# EAGLE design Tortilla (EAGLE 6.2)

## Sheet 1 of 5
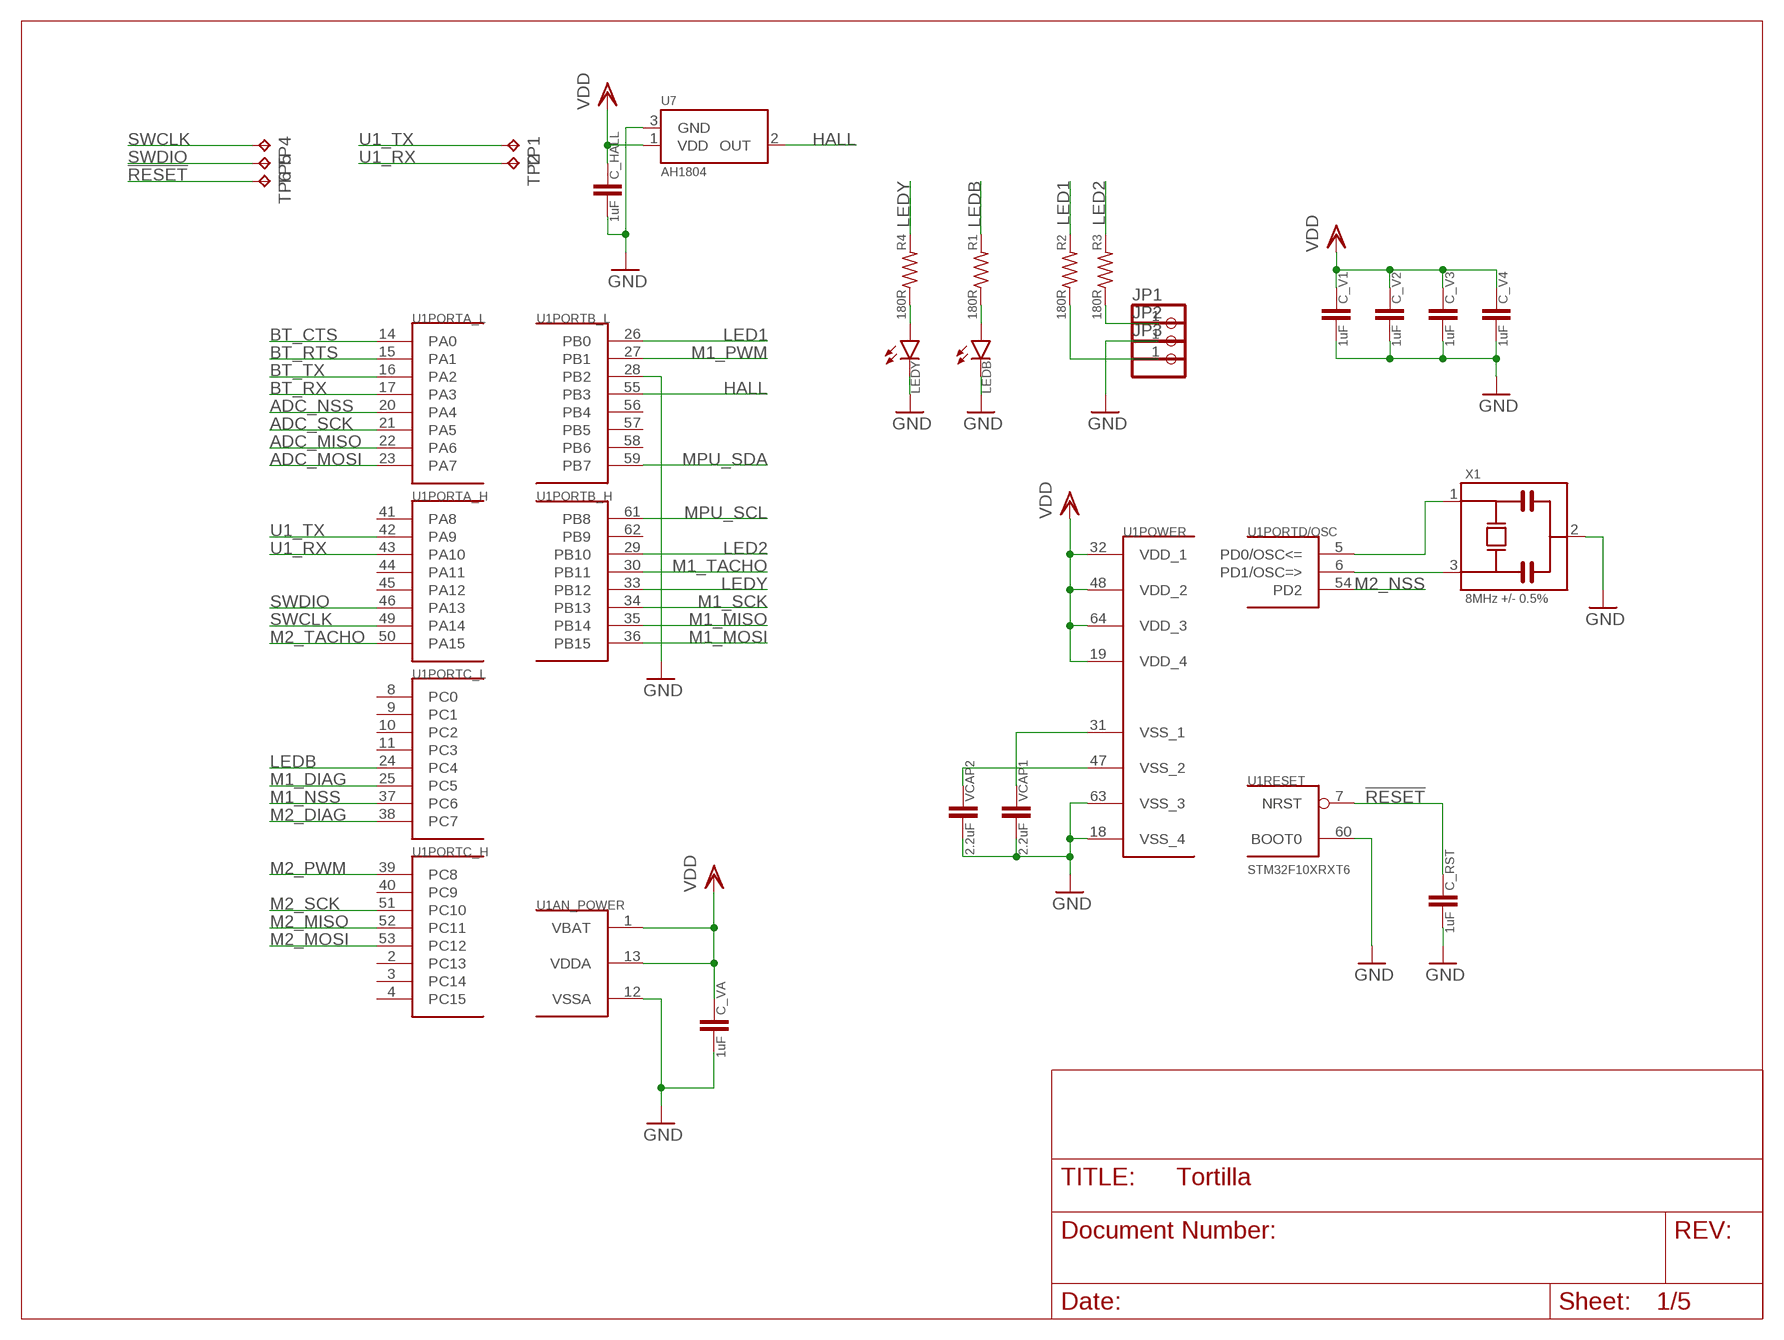
[diagram p0: schematic, sheet 1]

### Parts
C_HALL  1uF  C0603  [0603]
C_RST  1uF  C0603  [0603]
C_V1  1uF  C0603  [0603]
C_V2  1uF  C0603  [0603]
C_V3  1uF  C0603  [0603]
C_V4  1uF  C0603  [0603]
C_VA  1uF  C0603  [0603]
JP1  PINHD-1X1  [1X01]
JP2  PINHD-1X1  [1X01]
JP3  PINHD-1X1  [1X01]
LEDB  LED0805  [0805_POL]
LEDY  LED0805  [0805_POL]
R1  180R  R0603  [0603]
R2  180R  R0603  [0603]
R3  180R  R0603  [0603]
R4  180R  R0603  [0603]
TP1  TPB1,27  [B1,27]
TP2  TPB1,27  [B1,27]
TP4  TPB1,27  [B1,27]
TP5  TPB1,27  [B1,27]
TP6  TPB1,27  [B1,27]
U1  STM32F10XRXT6  [TQFP64]
U7  AH1804  [SOT23-3]
VCAP1  2.2uF  C0603  [0603]
VCAP2  2.2uF  C0603  [0603]
X1  8MHz +/- 0.5%  MURATA_CSTCE  [MURATA_CSTCE]

### Nets
!RESET: C_RST.1 TP6.TP U1.7(RESET:NRST)
ADC_MISO: U1.22(PORTA_L:PA6) ; also sheet 2
ADC_MOSI: U1.23(PORTA_L:PA7) ; also sheet 2
ADC_NSS: U1.20(PORTA_L:PA4) ; also sheet 2
ADC_SCK: U1.21(PORTA_L:PA5) ; also sheet 2
BT_CTS: U1.14(PORTA_L:PA0) ; also sheet 2
BT_RTS: U1.15(PORTA_L:PA1) ; also sheet 2
BT_RX: U1.17(PORTA_L:PA3) ; also sheet 2
BT_TX: U1.16(PORTA_L:PA2) ; also sheet 2
GND: C_HALL.2 C_RST.2 C_V1.2 C_V2.2 C_V3.2 C_V4.2 C_VA.2 JP2.1 LEDB.-(C) LEDY.-(C) U1.12(AN_POWER:VSSA) U1.18(POWER:VSS_4) U1.28(PORTB_L:PB2) U1.60(RESET:BOOT0) U1.63(POWER:VSS_3) U7.3(GND) VCAP1.2 VCAP2.2 X1.2 ; also sheet 2,3,4,5
HALL: U1.55(PORTB_L:PB3) U7.2(OUT)
LED1: R2.2 U1.26(PORTB_L:PB0)
LED2: R3.2 U1.29(PORTB_H:PB10)
LEDB: R1.2 U1.24(PORTC_L:PC4)
LEDY: R4.2 U1.33(PORTB_H:PB12)
M1_DIAG: U1.25(PORTC_L:PC5) ; also sheet 3
M1_MISO: U1.35(PORTB_H:PB14) ; also sheet 3
M1_MOSI: U1.36(PORTB_H:PB15) ; also sheet 3
M1_NSS: U1.37(PORTC_L:PC6) ; also sheet 3
M1_PWM: U1.27(PORTB_L:PB1) ; also sheet 3
M1_SCK: U1.34(PORTB_H:PB13) ; also sheet 3
M1_TACHO: U1.30(PORTB_H:PB11) ; also sheet 3
M2_DIAG: U1.38(PORTC_L:PC7) ; also sheet 4
M2_MISO: U1.52(PORTC_H:PC11) ; also sheet 4
M2_MOSI: U1.53(PORTC_H:PC12) ; also sheet 4
M2_NSS: U1.54(PORTD/OSC:PD2) ; also sheet 4
M2_PWM: U1.39(PORTC_H:PC8) ; also sheet 4
M2_SCK: U1.51(PORTC_H:PC10) ; also sheet 4
M2_TACHO: U1.50(PORTA_H:PA15) ; also sheet 4
MPU_SCL: U1.61(PORTB_H:PB8) ; also sheet 2
MPU_SDA: U1.59(PORTB_L:PB7) ; also sheet 2
N$1: U1.6(PORTD/OSC:PD1/OSC=>) X1.3
N$2: U1.5(PORTD/OSC:PD0/OSC<=) X1.1
N$3: U1.47(POWER:VSS_2) VCAP2.1
N$4: U1.31(POWER:VSS_1) VCAP1.1
N$5: LEDB.+(A) R1.1
N$6: JP1.1 R3.1
N$7: JP3.1 R2.1
N$35: LEDY.+(A) R4.1
SWCLK: TP4.TP U1.49(PORTA_H:PA14)
SWDIO: TP5.TP U1.46(PORTA_H:PA13)
U1_RX: TP2.TP U1.43(PORTA_H:PA10)
U1_TX: TP1.TP U1.42(PORTA_H:PA9)
VDD: C_HALL.1 C_V1.1 C_V2.1 C_V3.1 C_V4.1 C_VA.1 U1.1(AN_POWER:VBAT) U1.13(AN_POWER:VDDA) U1.19(POWER:VDD_4) U1.32(POWER:VDD_1) U1.48(POWER:VDD_2) U1.64(POWER:VDD_3) U7.1(VDD) ; also sheet 2,3,4,5
Unconnected: U1.2(PORTC_H:PC13) U1.3(PORTC_H:PC14) U1.4(PORTC_H:PC15) U1.8(PORTC_L:PC0) U1.9(PORTC_L:PC1) U1.10(PORTC_L:PC2) U1.11(PORTC_L:PC3) U1.40(PORTC_H:PC9) U1.41(PORTA_H:PA8) U1.44(PORTA_H:PA11) U1.45(PORTA_H:PA12) U1.56(PORTB_L:PB4) U1.57(PORTB_L:PB5) U1.58(PORTB_L:PB6) U1.62(PORTB_H:PB9)

## Sheet 2 of 5
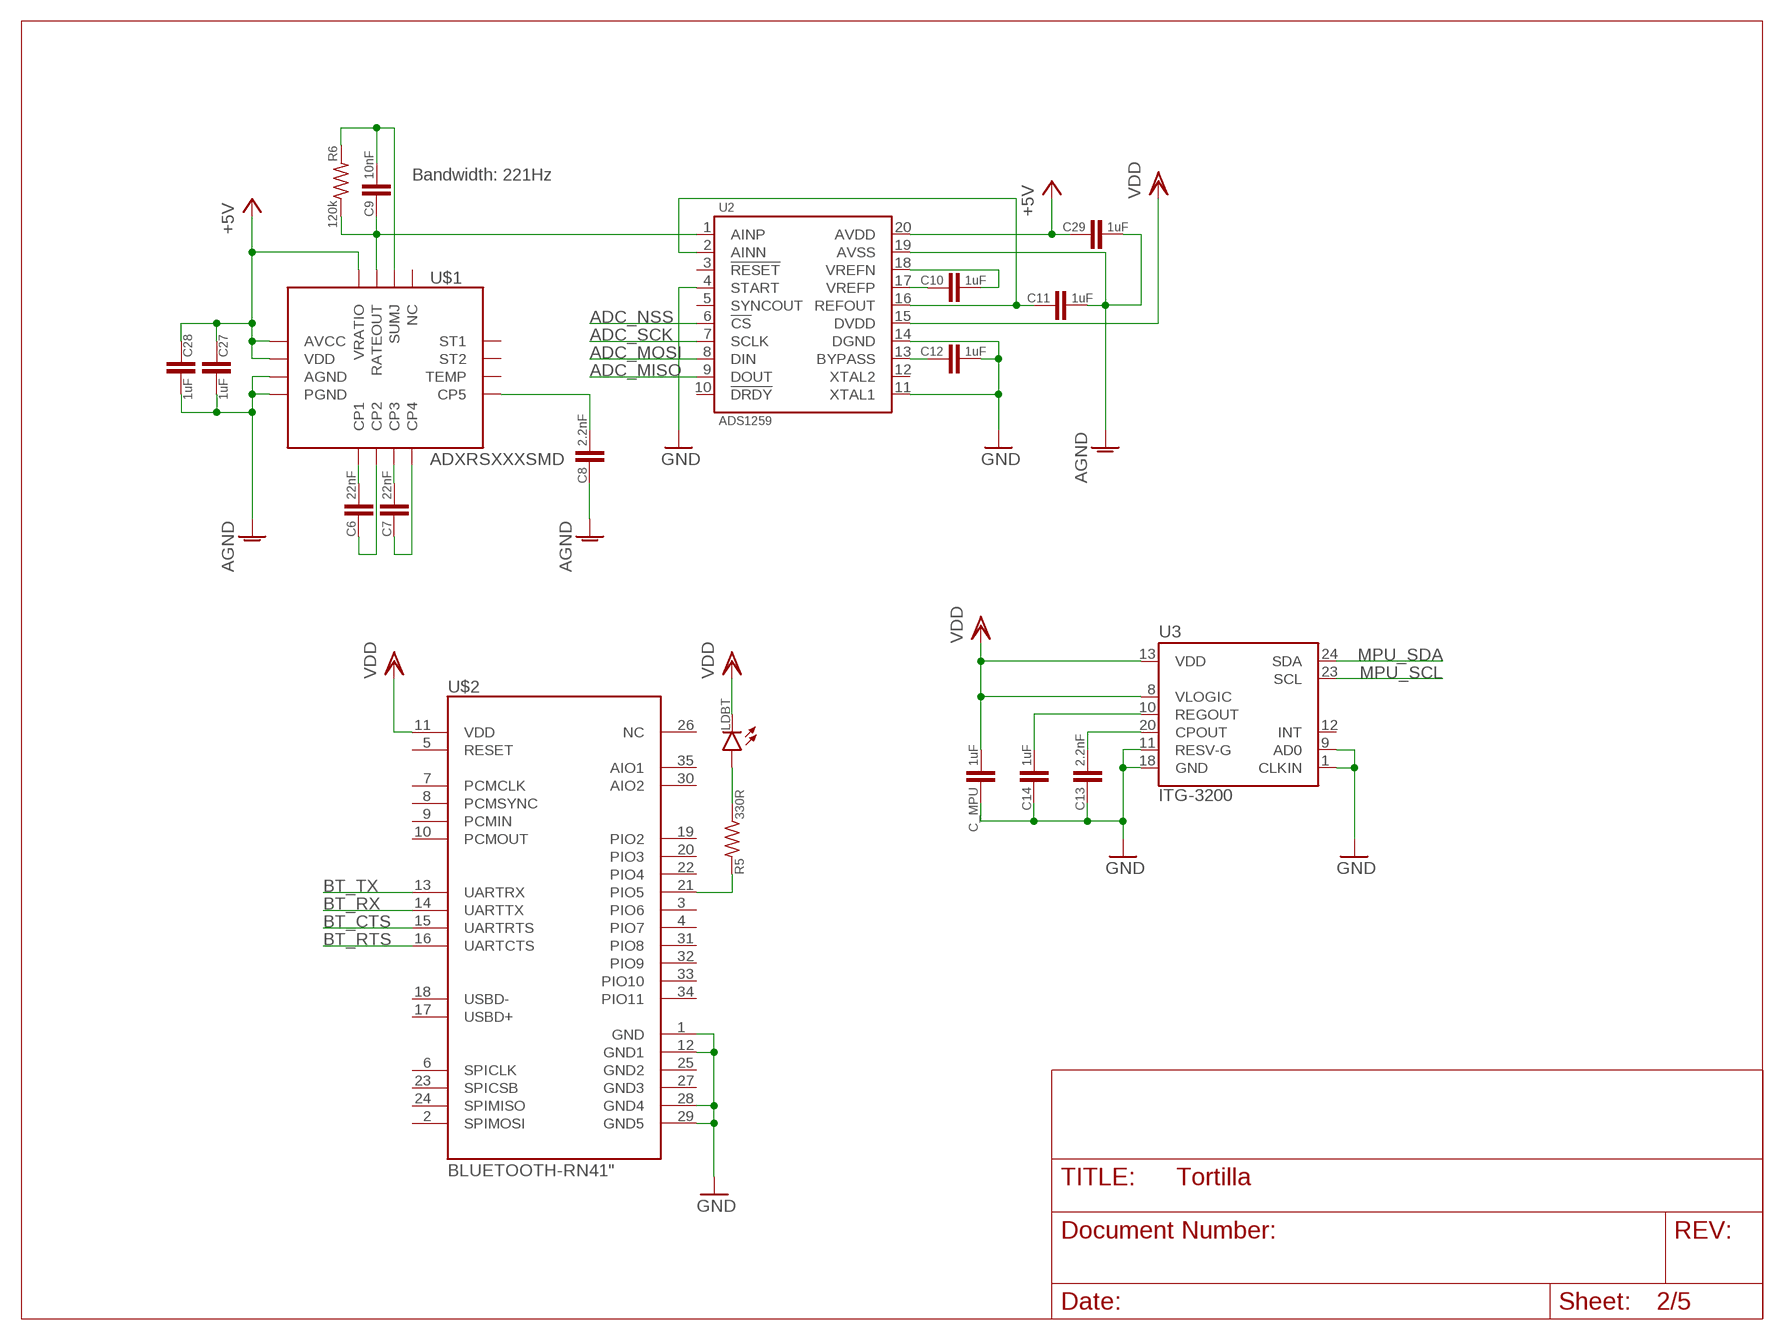
[diagram p1: schematic, sheet 2]

### Parts
C6  22nF  C0603  [0603]
C7  22nF  C0603  [0603]
C8  2.2nF  C0603  [0603]
C9  10nF  C0603  [0603]
C10  1uF  C0603  [0603]
C11  1uF  C0603  [0603]
C12  1uF  C0603  [0603]
C13  2.2nF  C0603  [0603]
C14  1uF  C0603  [0603]
C27  1uF  C0603  [0603]
C28  1uF  C0603  [0603]
C29  1uF  C0603  [0603]
C_MPU  1uF  C0603  [0603]
LDBT  LED0805  [0805_POL]
R5  330R  R0603  [0603]
R6  120k  R0603  [0603]
U2  ADS1259  [TSSOP-20]
U3  ITG-3200  [QFN-24]
U$1  ADXRSXXXSMD  [BC-32]
U$2  BLUETOOTH-RN41"  [RN41]

### Nets
+5V: C27.1 C28.1 C29.1 U2.20(AVDD) U$1.AVCC U$1.VDD U$1.VRATIO ; also sheet 5
ADC_MISO: U2.9(DOUT) ; also sheet 1
ADC_MOSI: U2.8(DIN) ; also sheet 1
ADC_NSS: U2.6(!CS) ; also sheet 1
ADC_SCK: U2.7(SCLK) ; also sheet 1
AGND: C8.1 C11.2 C27.2 C28.2 C29.2 U2.19(AVSS) U$1.AGND U$1.PGND ; also sheet 5
BT_CTS: U$2.15(UARTRTS) ; also sheet 1
BT_RTS: U$2.16(UARTCTS) ; also sheet 1
BT_RX: U$2.14(UARTTX) ; also sheet 1
BT_TX: U$2.13(UARTRX) ; also sheet 1
GND: C12.2 C13.1 C14.1 C_MPU.1 U2.4(START) U2.11(XTAL1) U2.14(DGND) U3.1(CLKIN) U3.9(AD0) U3.11(RESV-G) U3.18(GND) U$2.1(GND) U$2.12(GND1) U$2.28(GND4) U$2.29(GND5) ; also sheet 1,3,4,5
MPU_SCL: U3.23(SCL) ; also sheet 1
MPU_SDA: U3.24(SDA) ; also sheet 1
N$9: C6.2 U$1.CP1
N$10: C6.1 U$1.CP2
N$11: C7.2 U$1.CP3
N$12: C7.1 U$1.CP4
N$13: C8.2 U$1.CP5
N$14: C9.1 R6.1 U2.1(AINP) U$1.RATEOUT
N$15: C9.2 R6.2 U$1.SUMJ
N$16: C11.1 U2.2(AINN) U2.16(REFOUT)
N$17: C10.2 U2.18(VREFN)
N$18: C10.1 U2.17(VREFP)
N$19: C12.1 U2.13(BYPASS)
N$20: C13.2 U3.20(CPOUT)
N$21: C14.2 U3.10(REGOUT)
N$32: R5.2 U$2.21(PIO5)
N$33: LDBT.+(A) R5.1
VDD: C_MPU.2 LDBT.-(C) U2.15(DVDD) U3.8(VLOGIC) U3.13(VDD) U$2.11(VDD) ; also sheet 1,3,4,5
Unconnected: U2.3(!RESET) U2.5(SYNCOUT) U2.10(!DRDY) U2.12(XTAL2) U3.12(INT) U$1.NC U$1.ST1 U$1.ST2 U$1.TEMP U$2.2(SPIMOSI) U$2.3(PIO6) U$2.4(PIO7) U$2.5(RESET) U$2.6(SPICLK) U$2.7(PCMCLK) U$2.8(PCMSYNC) U$2.9(PCMIN) U$2.10(PCMOUT) U$2.17(USBD+) U$2.18(USBD-) U$2.19(PIO2) U$2.20(PIO3) U$2.22(PIO4) U$2.23(SPICSB) U$2.24(SPIMISO) U$2.25(GND2) U$2.26(NC) U$2.27(GND3) U$2.30(AIO2) U$2.31(PIO8) U$2.32(PIO9) U$2.33(PIO10) U$2.34(PIO11) U$2.35(AIO1)

### Notes on the sheet
- Bandwidth: 221Hz

## Sheet 3 of 5
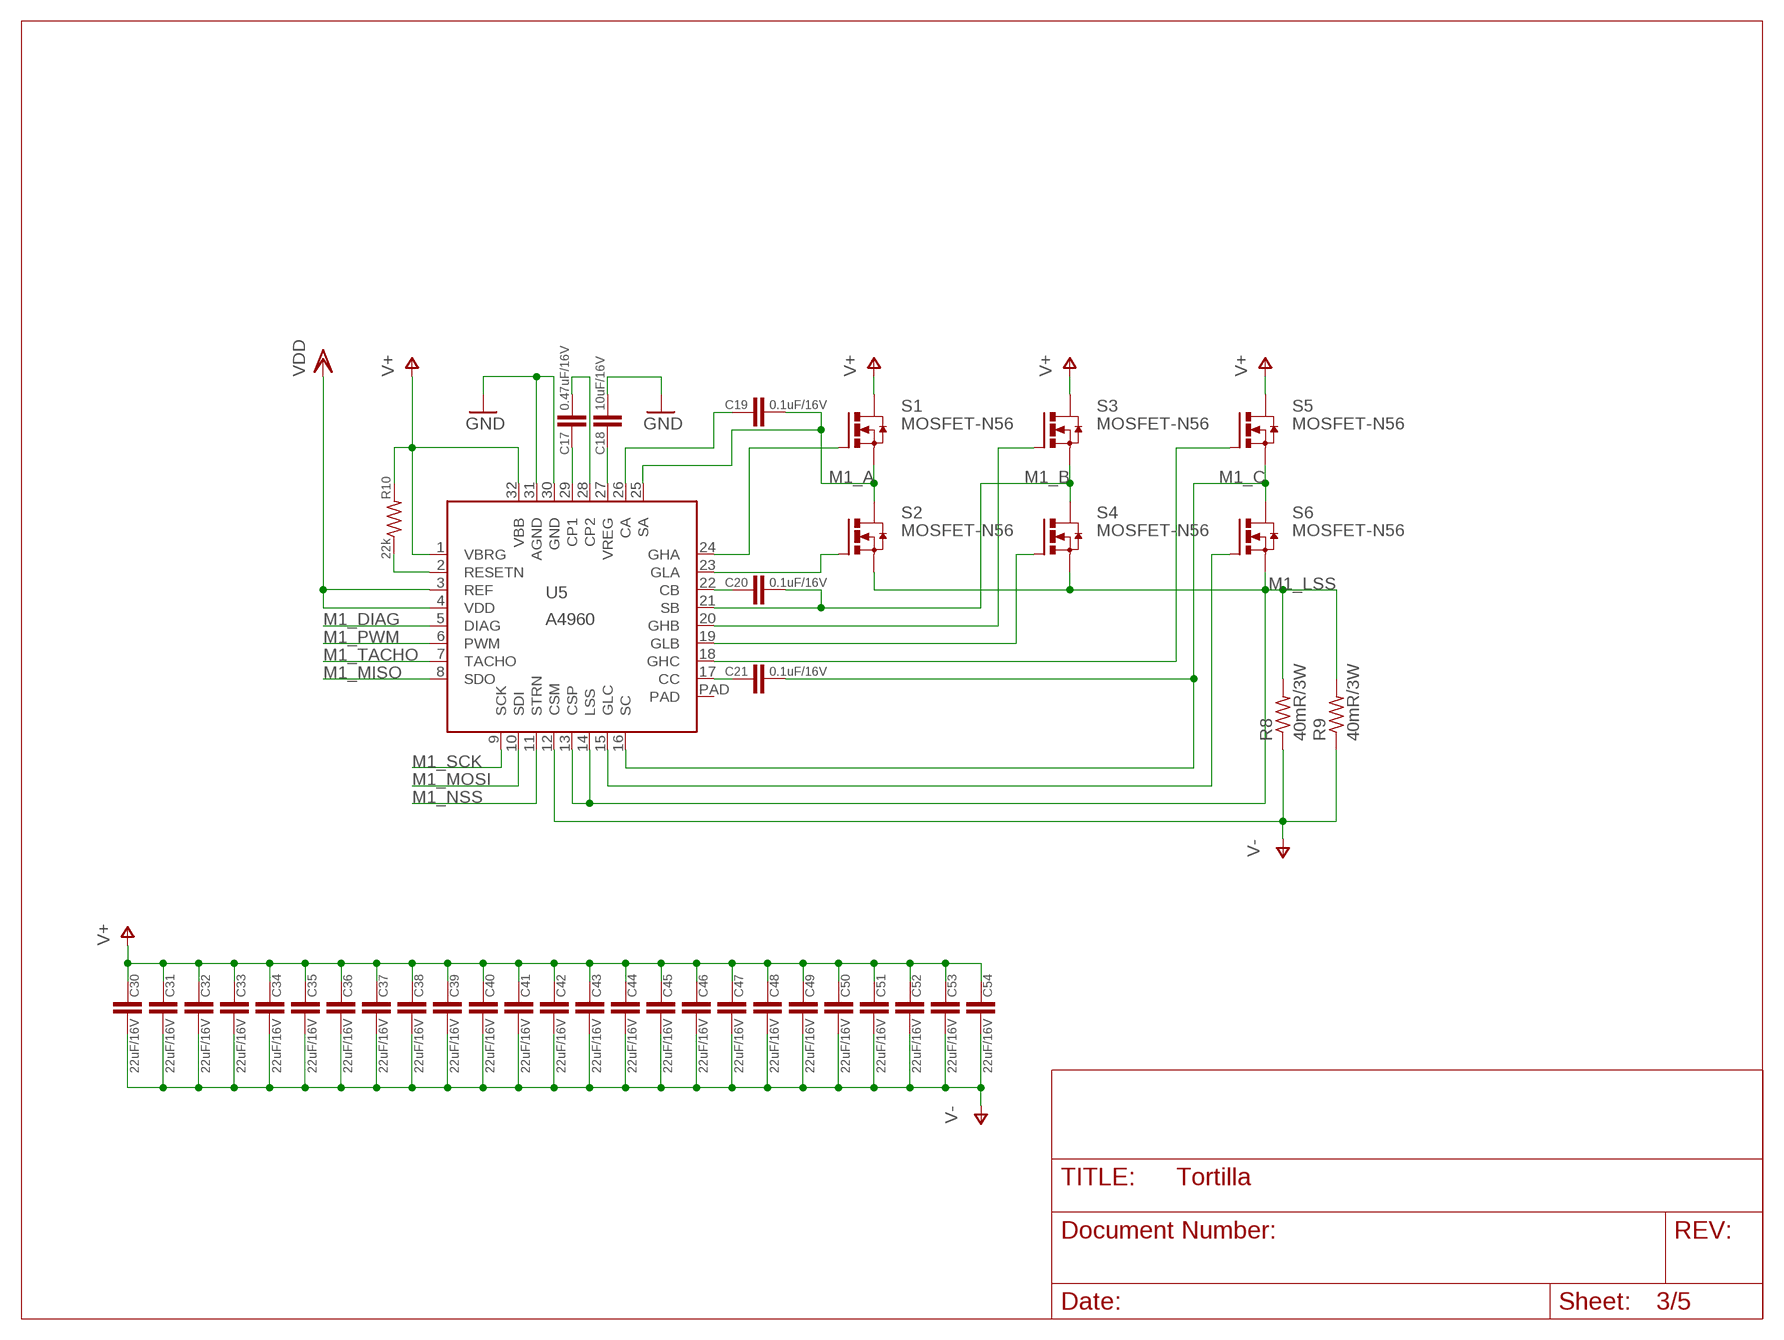
[diagram p2: schematic, sheet 3]

### Parts
C17  0.47uF/16V  C0603  [0603]
C18  10uF/16V  C0805  [0805]
C19  0.1uF/16V  C0603  [0603]
C20  0.1uF/16V  C0603  [0603]
C21  0.1uF/16V  C0603  [0603]
C30  22uF/16V  C1206  [1206]
C31  22uF/16V  C1206  [1206]
C32  22uF/16V  C1206  [1206]
C33  22uF/16V  C1206  [1206]
C34  22uF/16V  C1206  [1206]
C35  22uF/16V  C1206  [1206]
C36  22uF/16V  C1206  [1206]
C37  22uF/16V  C1206  [1206]
C38  22uF/16V  C1206  [1206]
C39  22uF/16V  C1206  [1206]
C40  22uF/16V  C1206  [1206]
C41  22uF/16V  C1206  [1206]
C42  22uF/16V  C1206  [1206]
C43  22uF/16V  C1206  [1206]
C44  22uF/16V  C1206  [1206]
C45  22uF/16V  C1206  [1206]
C46  22uF/16V  C1206  [1206]
C47  22uF/16V  C1206  [1206]
C48  22uF/16V  C1206  [1206]
C49  22uF/16V  C1206  [1206]
C50  22uF/16V  C1206  [1206]
C51  22uF/16V  C1206  [1206]
C52  22uF/16V  C1206  [1206]
C53  22uF/16V  C1206  [1206]
C54  22uF/16V  C1206  [1206]
R8  40mR/3W  R-US_R2512  [R2512]
R9  40mR/3W  R-US_R2512  [R2512]
R10  22k  R0603  [0603]
S1  MOSFET-N56  [SON-5X6]
S2  MOSFET-N56  [SON-5X6]
S3  MOSFET-N56  [SON-5X6]
S4  MOSFET-N56  [SON-5X6]
S5  MOSFET-N56  [SON-5X6]
S6  MOSFET-N56  [SON-5X6]
U5  A4960  [LQFP32-THERMPAD]

### Nets
GND: C18.2 U5.30(GND) U5.31(AGND) ; also sheet 1,2,4,5
M1_A: C19.2 S1.S1(S) S1.S2(S) S1.S3(S) S2.D U5.25(SA)
M1_B: C20.2 S3.S1(S) S3.S2(S) S3.S3(S) S4.D U5.21(SB)
M1_C: C21.2 S5.S1(S) S5.S2(S) S5.S3(S) S6.D U5.16(SC)
M1_DIAG: U5.5(DIAG) ; also sheet 1
M1_LSS: R8.2 R9.2 S2.S1(S) S2.S2(S) S2.S3(S) S4.S1(S) S4.S2(S) S4.S3(S) S6.S1(S) S6.S2(S) S6.S3(S) U5.13(CSP) U5.14(LSS)
M1_MISO: U5.8(SDO) ; also sheet 1
M1_MOSI: U5.10(SDI) ; also sheet 1
M1_NSS: U5.11(STRN) ; also sheet 1
M1_PWM: U5.6(PWM) ; also sheet 1
M1_SCK: U5.9(SCK) ; also sheet 1
M1_TACHO: U5.7(TACHO) ; also sheet 1
N$24: C17.1 U5.29(CP1)
N$25: C17.2 U5.28(CP2)
N$26: C18.1 U5.27(VREG)
N$30: S1.G U5.24(GHA)
N$31: S2.G U5.23(GLA)
N$37: C19.1 U5.26(CA)
N$39: S3.G U5.20(GHB)
N$40: S4.G U5.19(GLB)
N$41: C20.1 U5.22(CB)
N$42: S5.G U5.18(GHC)
N$44: S6.G U5.15(GLC)
N$45: C21.1 U5.17(CC)
N$48: R10.1 U5.2(RESETN)
V+: C30.1 C31.1 C32.1 C33.1 C34.1 C35.1 C36.1 C37.1 C38.1 C39.1 C40.1 C41.1 C42.1 C43.1 C44.1 C45.1 C46.1 C47.1 C48.1 C49.1 C50.1 C51.1 C52.1 C53.1 C54.1 R10.2 S1.D S3.D S5.D U5.1(VBRG) U5.32(VBB) ; also sheet 4,5
V-: C30.2 C31.2 C32.2 C33.2 C34.2 C35.2 C36.2 C37.2 C38.2 C39.2 C40.2 C41.2 C42.2 C43.2 C44.2 C45.2 C46.2 C47.2 C48.2 C49.2 C50.2 C51.2 C52.2 C53.2 C54.2 R8.1 R9.1 U5.12(CSM) ; also sheet 4,5
VDD: U5.3(REF) U5.4(VDD) ; also sheet 1,2,4,5
Unconnected: U5.PAD

## Sheet 4 of 5
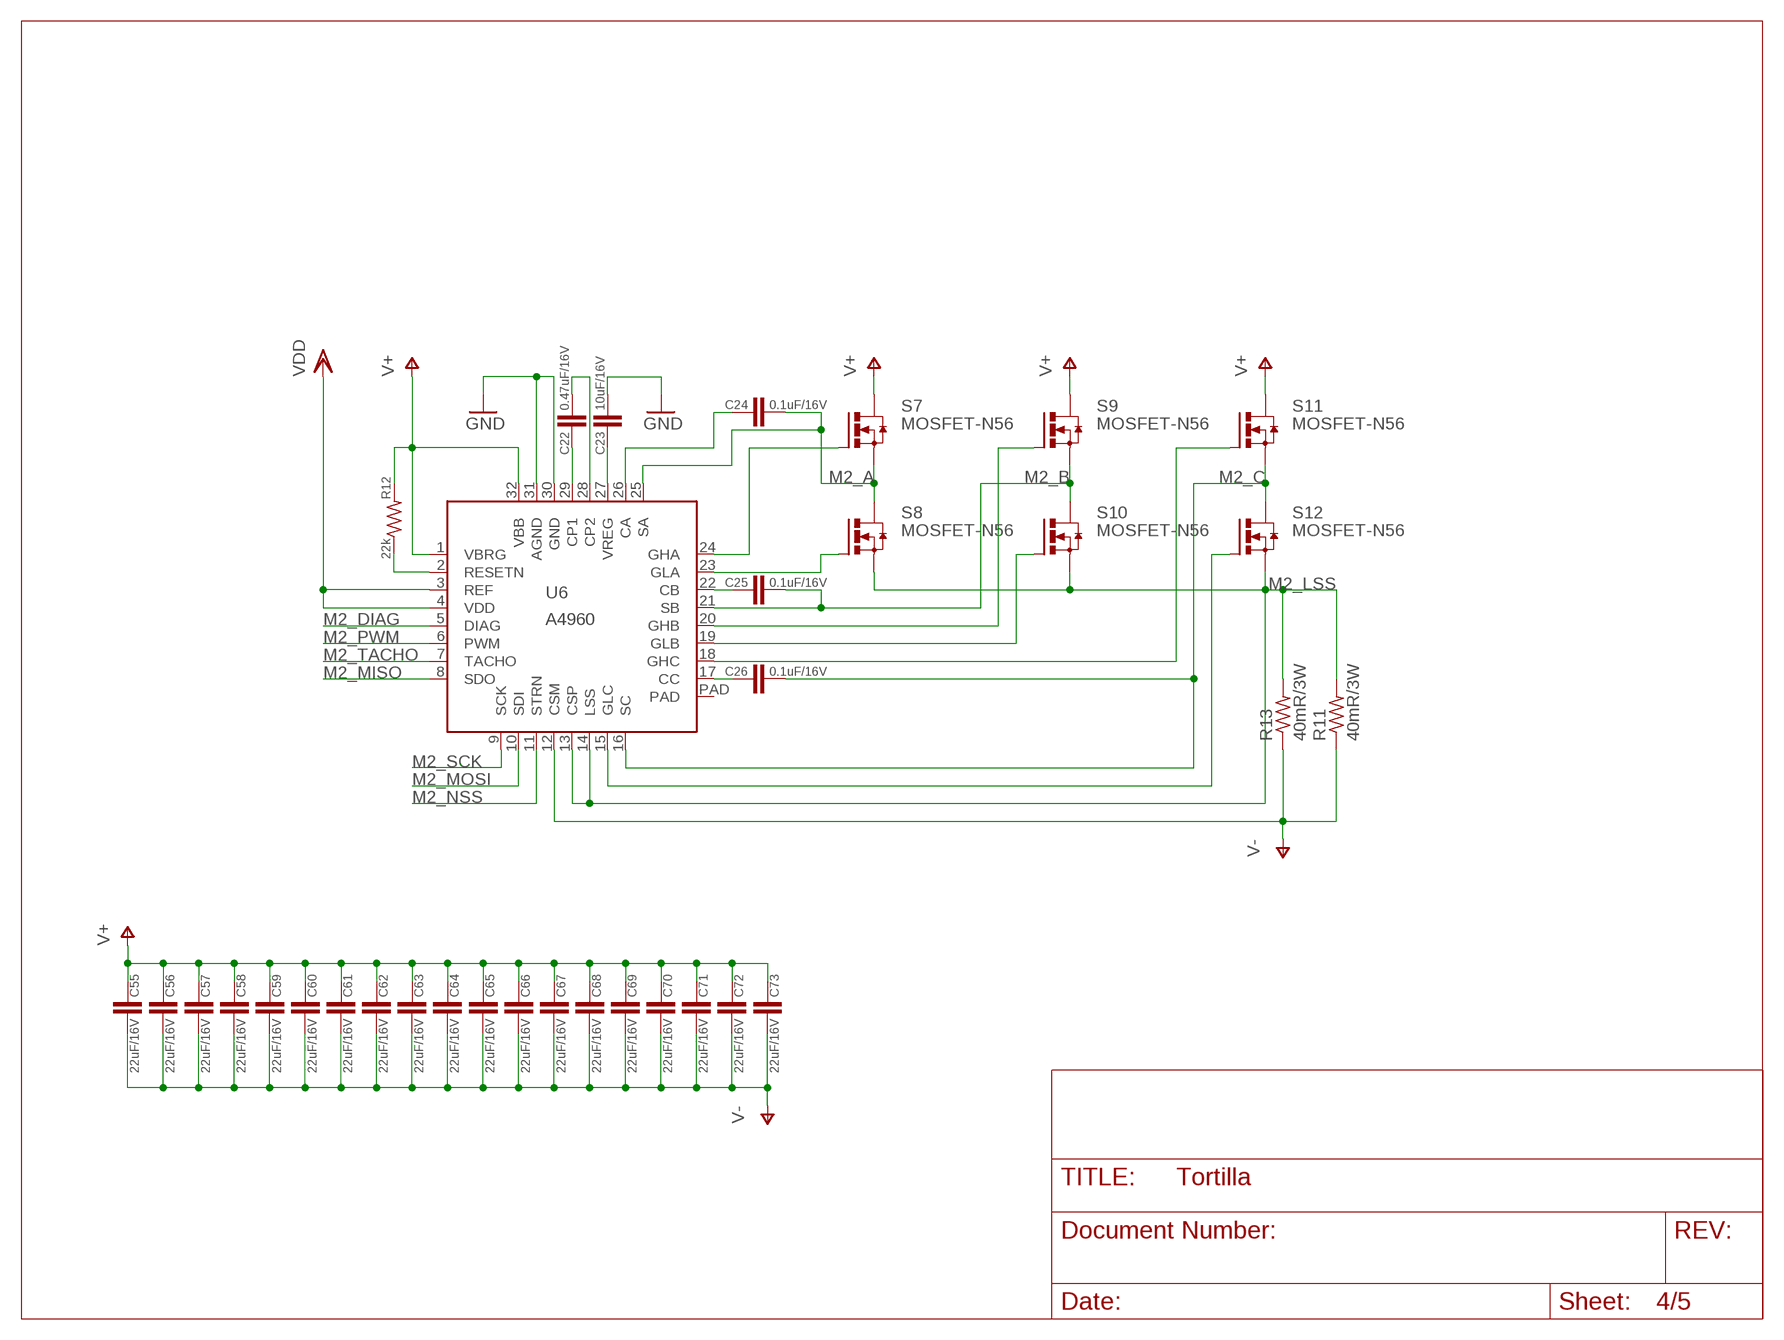
[diagram p3: schematic, sheet 4]

### Parts
C22  0.47uF/16V  C0603  [0603]
C23  10uF/16V  C0805  [0805]
C24  0.1uF/16V  C0603  [0603]
C25  0.1uF/16V  C0603  [0603]
C26  0.1uF/16V  C0603  [0603]
C55  22uF/16V  C1206  [1206]
C56  22uF/16V  C1206  [1206]
C57  22uF/16V  C1206  [1206]
C58  22uF/16V  C1206  [1206]
C59  22uF/16V  C1206  [1206]
C60  22uF/16V  C1206  [1206]
C61  22uF/16V  C1206  [1206]
C62  22uF/16V  C1206  [1206]
C63  22uF/16V  C1206  [1206]
C64  22uF/16V  C1206  [1206]
C65  22uF/16V  C1206  [1206]
C66  22uF/16V  C1206  [1206]
C67  22uF/16V  C1206  [1206]
C68  22uF/16V  C1206  [1206]
C69  22uF/16V  C1206  [1206]
C70  22uF/16V  C1206  [1206]
C71  22uF/16V  C1206  [1206]
C72  22uF/16V  C1206  [1206]
C73  22uF/16V  C1206  [1206]
R11  40mR/3W  R-US_R2512  [R2512]
R12  22k  R0603  [0603]
R13  40mR/3W  R-US_R2512  [R2512]
S7  MOSFET-N56  [SON-5X6]
S8  MOSFET-N56  [SON-5X6]
S9  MOSFET-N56  [SON-5X6]
S10  MOSFET-N56  [SON-5X6]
S11  MOSFET-N56  [SON-5X6]
S12  MOSFET-N56  [SON-5X6]
U6  A4960  [LQFP32-THERMPAD]

### Nets
GND: C23.2 U6.30(GND) U6.31(AGND) ; also sheet 1,2,3,5
M2_A: C24.2 S7.S1(S) S7.S2(S) S7.S3(S) S8.D U6.25(SA)
M2_B: C25.2 S9.S1(S) S9.S2(S) S9.S3(S) S10.D U6.21(SB)
M2_C: C26.2 S11.S1(S) S11.S2(S) S11.S3(S) S12.D U6.16(SC)
M2_DIAG: U6.5(DIAG) ; also sheet 1
M2_LSS: R11.2 R13.2 S8.S1(S) S8.S2(S) S8.S3(S) S10.S1(S) S10.S2(S) S10.S3(S) S12.S1(S) S12.S2(S) S12.S3(S) U6.13(CSP) U6.14(LSS)
M2_MISO: U6.8(SDO) ; also sheet 1
M2_MOSI: U6.10(SDI) ; also sheet 1
M2_NSS: U6.11(STRN) ; also sheet 1
M2_PWM: U6.6(PWM) ; also sheet 1
M2_SCK: U6.9(SCK) ; also sheet 1
M2_TACHO: U6.7(TACHO) ; also sheet 1
N$34: C22.2 U6.28(CP2)
N$36: C22.1 U6.29(CP1)
N$47: C23.1 U6.27(VREG)
N$50: S7.G U6.24(GHA)
N$51: S8.G U6.23(GLA)
N$52: C24.1 U6.26(CA)
N$54: S9.G U6.20(GHB)
N$55: S10.G U6.19(GLB)
N$56: C25.1 U6.22(CB)
N$57: S11.G U6.18(GHC)
N$59: S12.G U6.15(GLC)
N$60: C26.1 U6.17(CC)
N$62: R12.1 U6.2(RESETN)
V+: C55.1 C56.1 C57.1 C58.1 C59.1 C60.1 C61.1 C62.1 C63.1 C64.1 C65.1 C66.1 C67.1 C68.1 C69.1 C70.1 C71.1 C72.1 C73.1 R12.2 S7.D S9.D S11.D U6.1(VBRG) U6.32(VBB) ; also sheet 3,5
V-: C55.2 C56.2 C57.2 C58.2 C59.2 C60.2 C61.2 C62.2 C63.2 C64.2 C65.2 C66.2 C67.2 C68.2 C69.2 C70.2 C71.2 C72.2 C73.2 R11.1 R13.1 U6.12(CSM) ; also sheet 3,5
VDD: U6.3(REF) U6.4(VDD) ; also sheet 1,2,3,5
Unconnected: U6.PAD

## Sheet 5 of 5
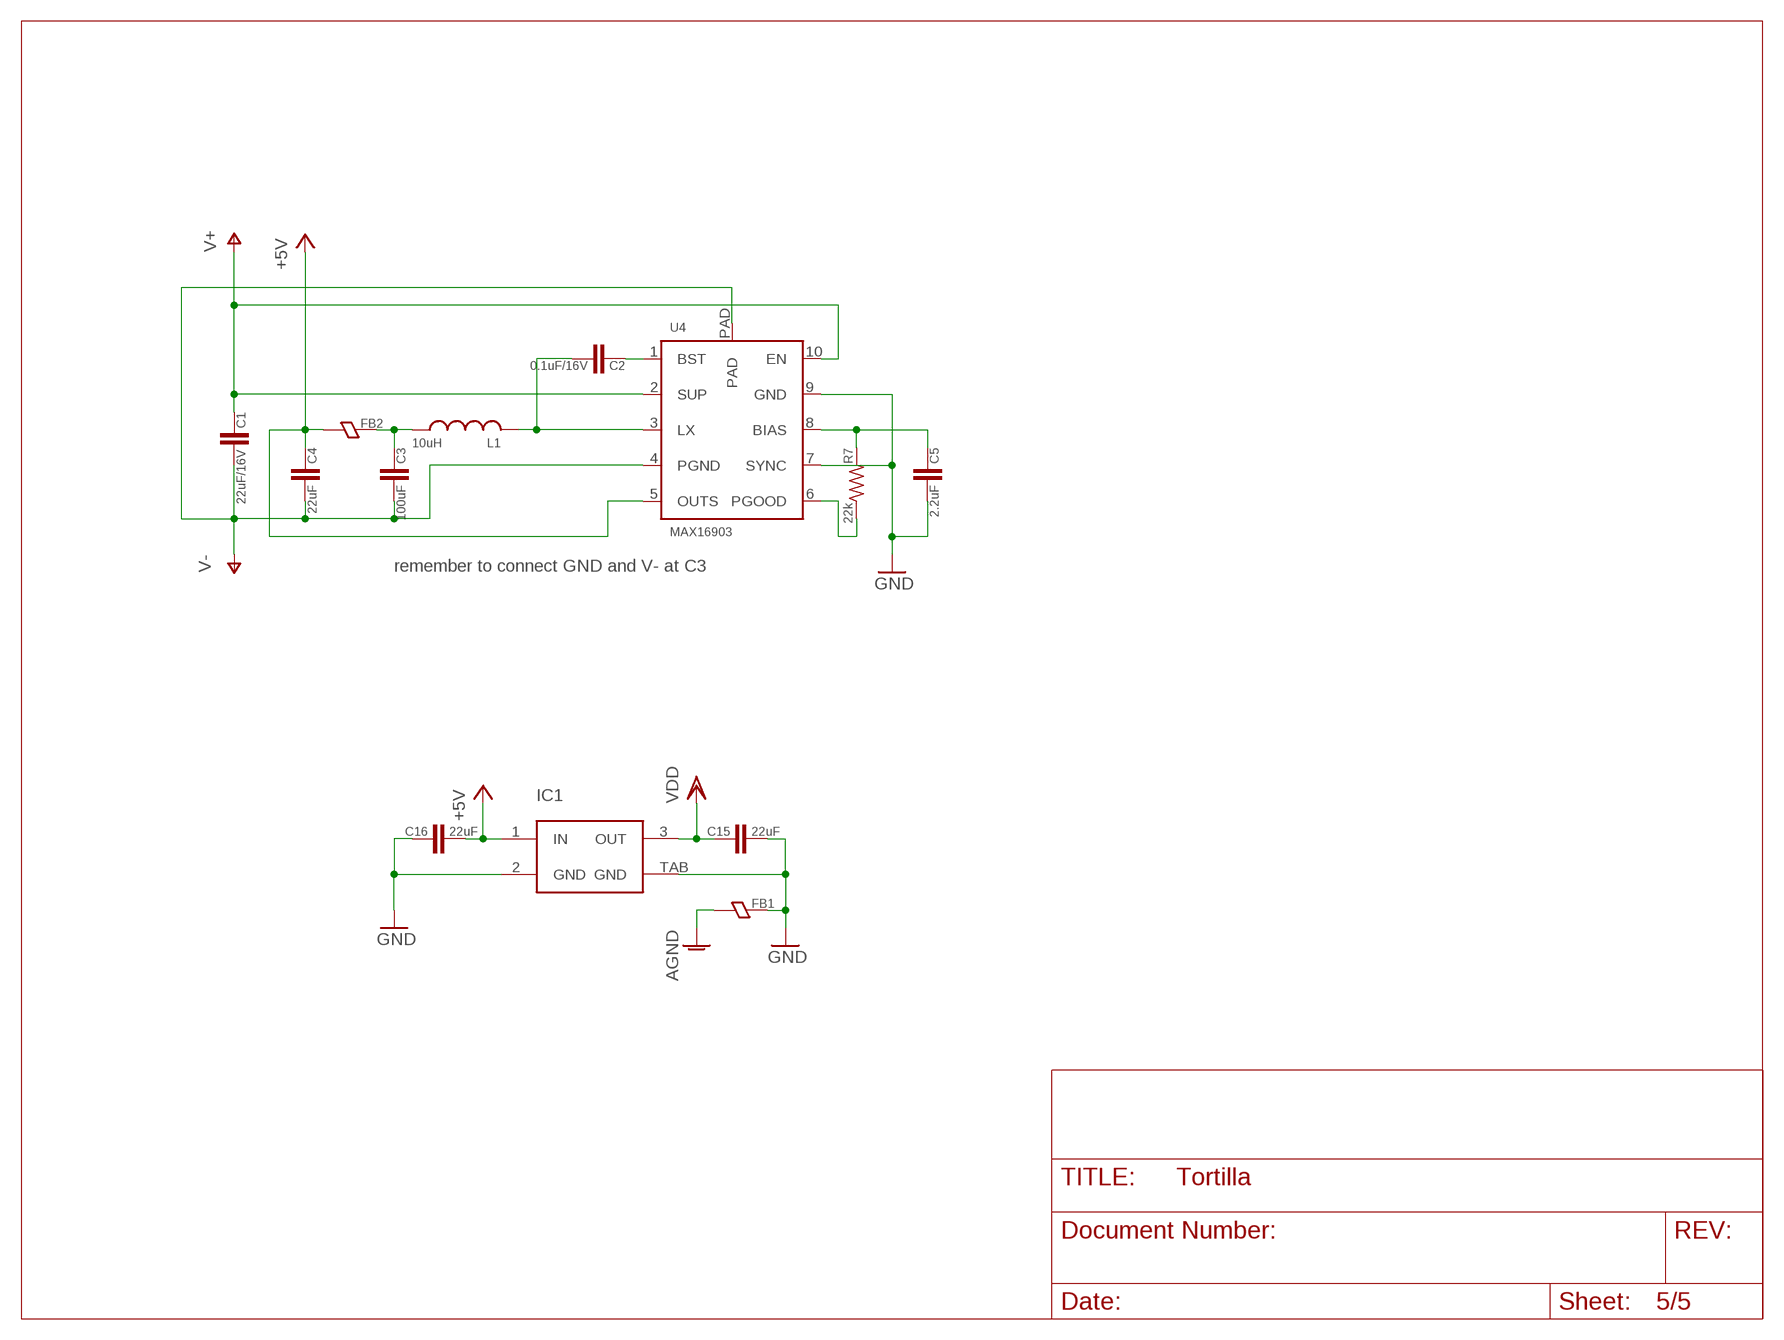
[diagram p4: schematic, sheet 5]

### Parts
C1  22uF/16V  C0805  [0805]
C2  0.1uF/16V  C0603  [0603]
C3  100uF  C1206  [1206]
C4  22uF  C0805  [0805]
C5  2.2uF  C0603  [0603]
C15  22uF  C0805  [0805]
C16  22uF  C0805  [0805]
FB1  FERRITE0603  [0603]
FB2  FERRITE0603  [0603]
IC1  MCP1826S  [SOT223-3L]
L1  10uH  L-US_NR30  [TAIYO-YUDEN_NR30]
R7  22k  R0603  [0603]
U4  MAX16903  [TDFN-10]

### Nets
+5V: C4.1 C16.2 FB2.1 IC1.1(IN) U4.5(OUTS) ; also sheet 2
AGND: FB1.1 ; also sheet 2
GND: C5.2 C15.2 C16.1 FB1.2 IC1.2(GND) IC1.TAB(GND) U4.7(SYNC) U4.9(GND) ; also sheet 1,2,3,4
N$8: C2.1 U4.1(BST)
N$22: C2.2 L1.2 U4.3(LX)
N$23: C3.1 FB2.2 L1.1
N$28: C5.1 R7.2 U4.8(BIAS)
N$29: R7.1 U4.6(PGOOD)
V+: C1.1 U4.2(SUP) U4.10(EN) ; also sheet 3,4
V-: C1.2 C3.2 C4.2 U4.4(PGND) U4.PAD ; also sheet 3,4
VDD: C15.1 IC1.3(OUT) ; also sheet 1,2,3,4

### Notes on the sheet
- remember to connect GND and V- at C3

## Library data of the parts
C1-C73 C_HALL C_MPU C_RST C_V1-C_V4 C_VA VCAP1 VCAP2 = dan-rcl:C
FB1 FB2 = dan-rcl:FERRITE: Ferrite Bead
IC1 = dan-vreg:MCP1826S: MCP1826S 1A LDO Features 1000 mA Output Current Capability Input Operating Voltage Range: 2.3V to 6.0V Standard Fixed Output Voltages: 0.8V, 1.2V, 1.8V, 2.5V, 3.0V, 3.3V, 5.0V Low Dropout Voltage: 250 mV Typical at 1000 mA Typical Output Voltage Tolerance: 0.5% Stable with 1.0 µF Ceramic Output Capacitor Fast response to Load Transients Low Supply Current: 120 µA (typ) Short Circuit Current Limiting and Overtemperature Protection TO-263-3 (DDPAK-3), TO-220-3, SOT-223-3 Package Options (MCP1826S).
JP1-JP3 = pinhead:PINHD-1X1: PIN HEADER
L1 = xow:L-US
LDBT LEDB LEDY = dan-led:LED: LED
R1-R7 R10 R12 = dan-rcl:R
R8 R9 R11 R13 = rcl:R-US_: RESISTOR, American symbol
S1-S12 = xow:MOSFET-N: Power NMOSFETs in: - D2PAK-7 - 5mm x 6mm (Power56/PQFN 5x6)
TP1 TP2 TP4-TP6 = testpad:TP: Test pad
U1 = stm32:STM32F10XRXT6: STM32F101/103 64pin LQFP
U2 = xow:ADS1259
U3 = SparkFun-Sensors:ITG-3200: ITG-3200 3-axis gyro, digital output, qfn24 package
U4 = xow:MAX16903
U5 U6 = xow:A4960
U7 = xow:AH1804
U$1 = SparkFun-Sensors:ADXRSXXX: Various MEMS gyros- ADXRS6xx, 150, 300, 401
U$2 = SparkFun-RF:BLUETOOTH-RN41: Bluetooth SMD module
X1 = xow:MURATA_CSTCE

## Board
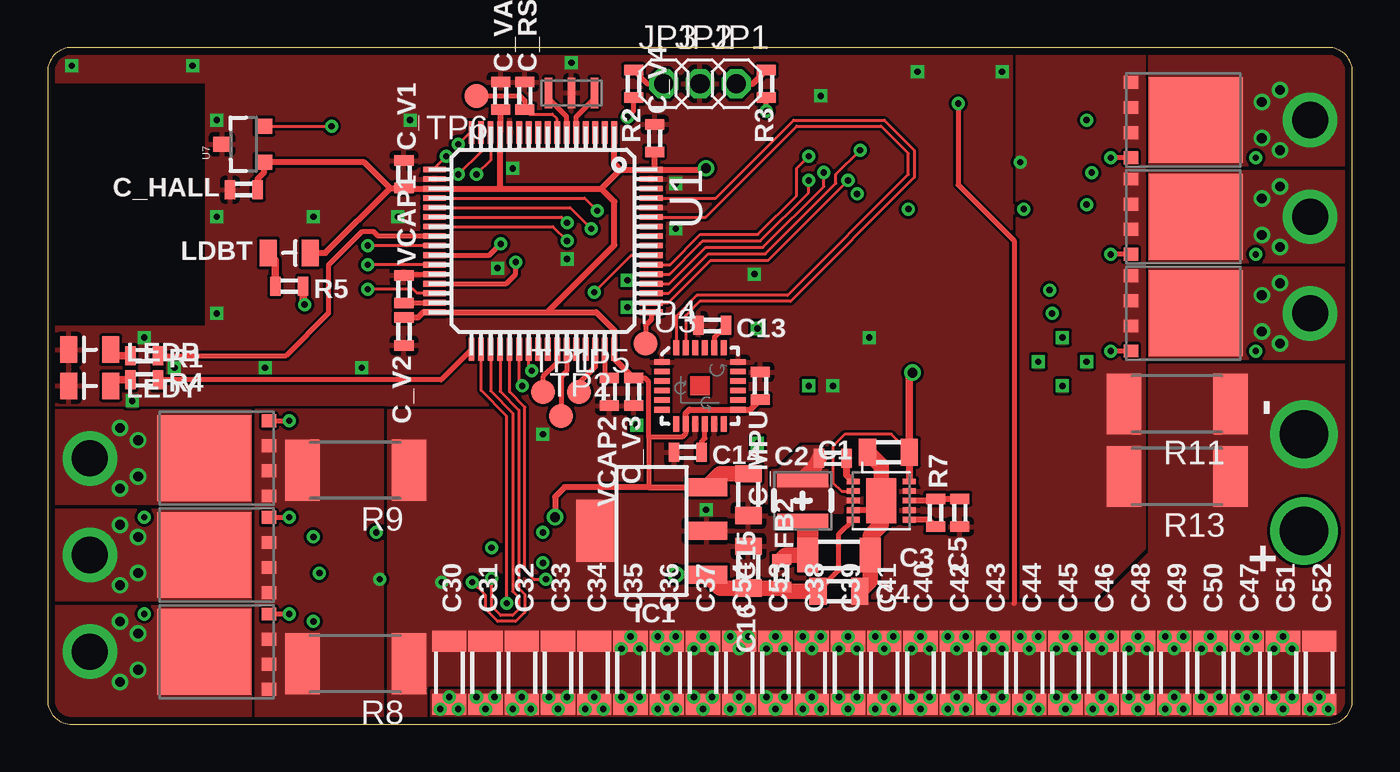
[diagram p5: board, top side]
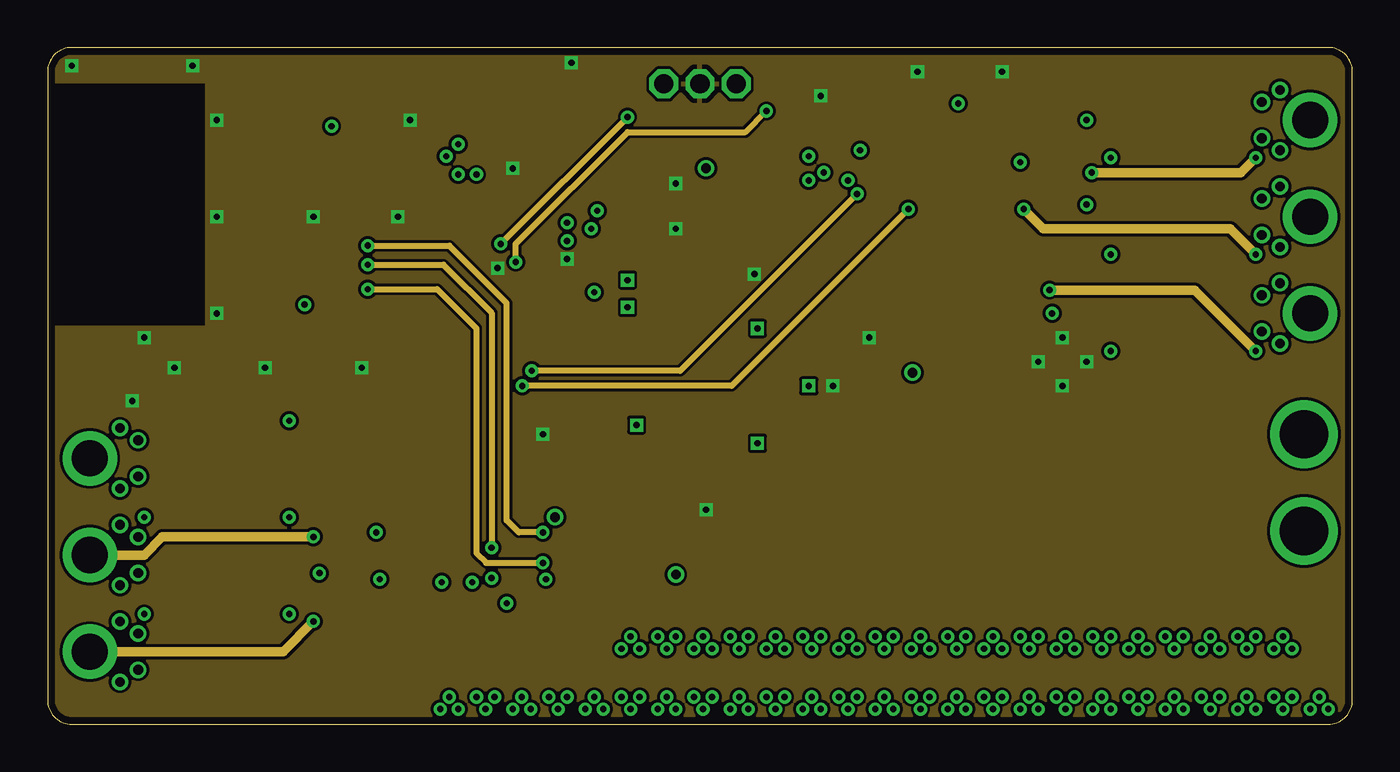
[diagram p6: board, inner layer Route2]
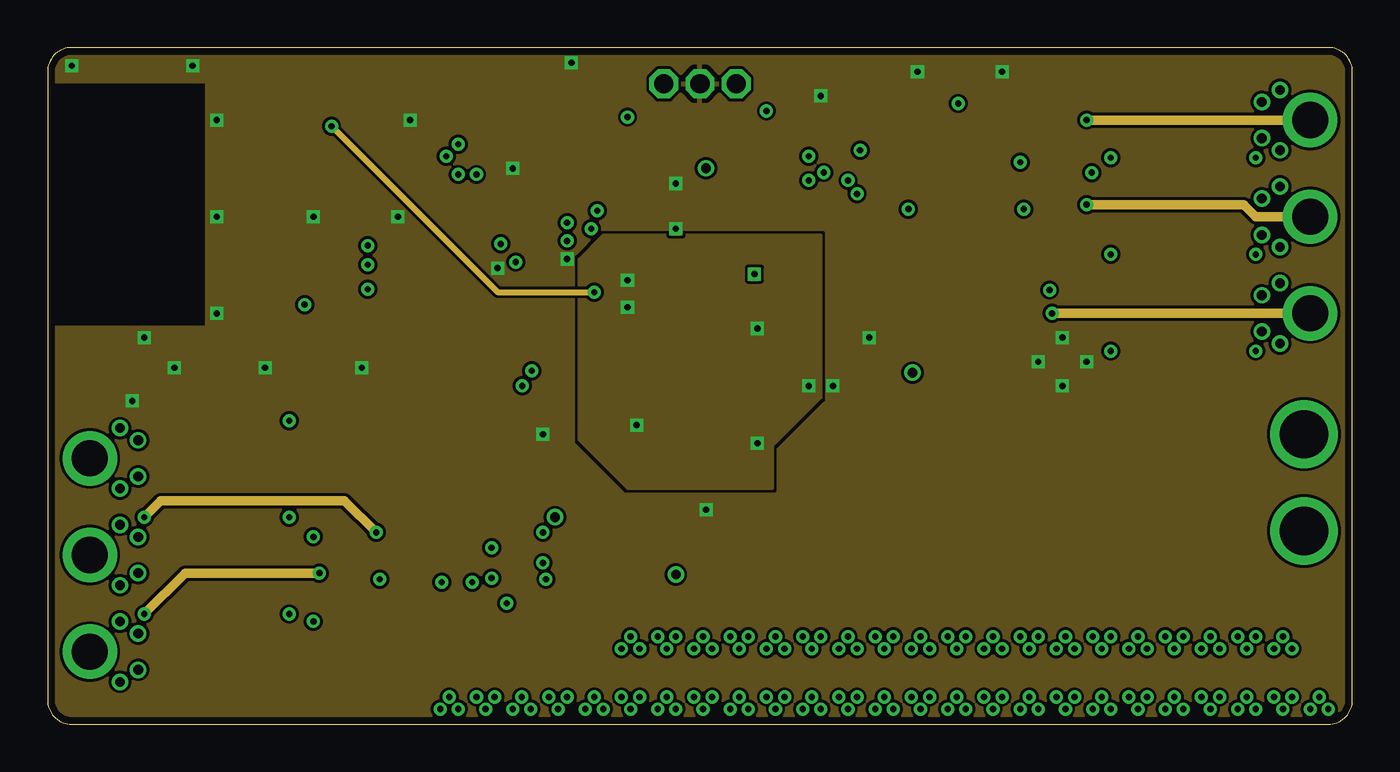
[diagram p7: board, inner layer Route15]
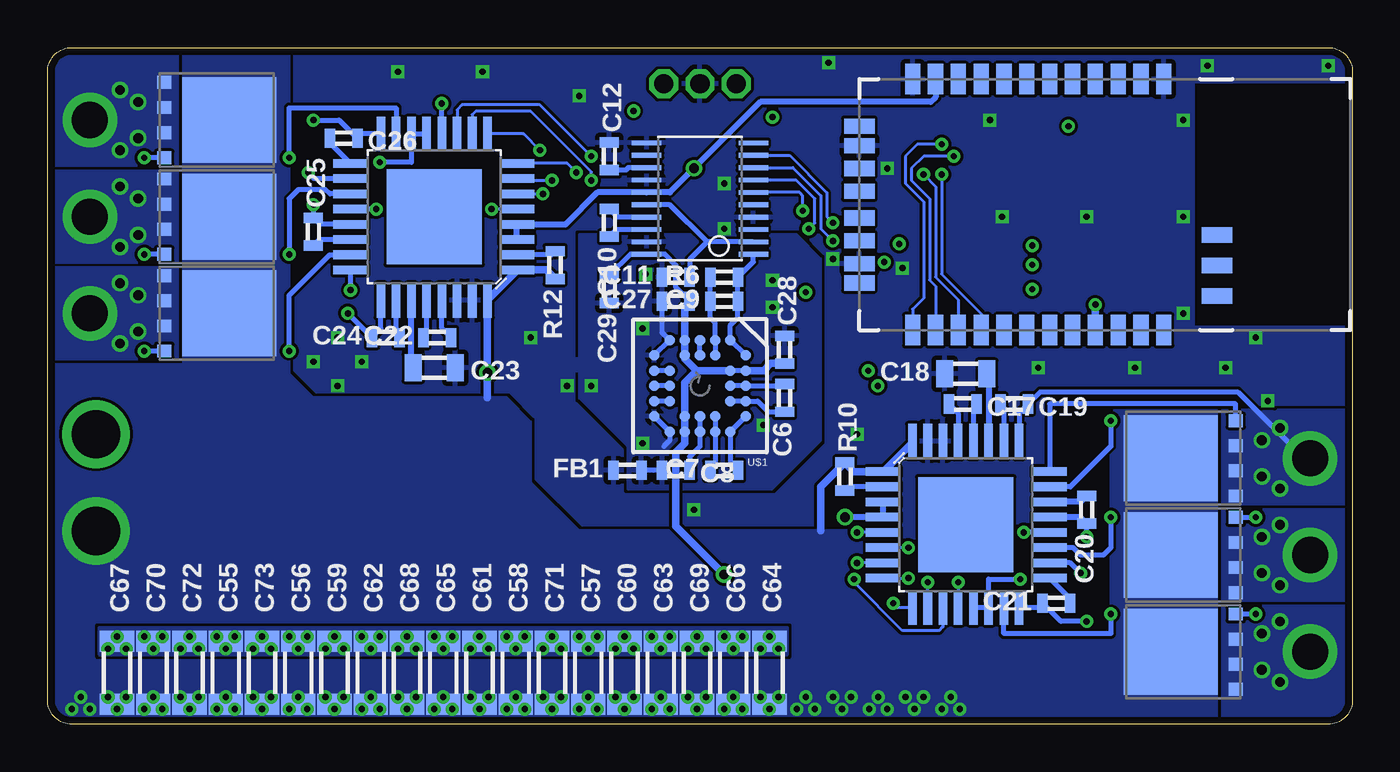
[diagram p8: board, bottom side, seen from below]

Size 68.58 x 35.56 mm. Coordinates in mm from the lower left corner, seen from the top.
Outline: 0,34.29 0,1.27 arc90 1.27,0 67.31,0 arc90 68.58,1.27 68.58,34.29 arc90 67.31,35.56 1.27,35.56 arc90 0,34.29
Copper layers (1+2*15+16): Top 0.0356mm / dielectric 0.19811875mm / Route2 0.0178mm / dielectric 39mil / Route15 0.0178mm / dielectric 0.19811875mm / Bottom 0.0356mm
Design rules: minimum track width 6mil, minimum drill 13mil, track to track 6mil, track to pad 6mil, pad to pad 6mil, via to via 6mil, smd to smd 0mil, copper to edge 15mil, drill to drill 6mil, minimum pad ring 7mil, minimum via ring 7mil, stop-mask expansion 4mil, vias tented up to drill 13mil, thermal gap 10mil

### Footprints (pad centres in the part's own frame; a part is rotated, then mirrored left to right if it is on the bottom)
0805 = smd 0.9 x 1.4: 1 -1.1,0; 2 1.1,0
0603 = smd 0.55 x 1: 1 -0.725,0; 2 0.725,0
1206 = smd 1.1 x 1.8: 1 -1.65,0; 2 1.65,0
SOT223-3L = smd 0.95 x 2.15: 1 -2.3,-2.9; 2 0,-2.9; 3 2.3,-2.9 | smd 3.25 x 2.15: TAB 0,2.9
1X01 = drill 1.016 octagon: 1 0,0
TAIYO-YUDEN_NR30 = smd 0.8 x 2.7: 1 -1.1,0; 2 1.1,0
0805_POL = smd 0.9 x 1.4: + 1.1,0; - -1.1,0
R2512 = smd 1.8 x 3.2: 1 -2.8,0; 2 2.8,0
SON-5X6 = smd 4.95 x 4.51: D -0.652,0 | smd 0.75 x 0.675: G 2.752,1.98; S1 2.752,-1.98; S2 2.752,-0.66; S3 2.752,0.66
B1,27 = smd 1.27 x 1.27: TP 0,0
TQFP64 = smd 1.2 x 0.3: 1 -5.7,3.75; 2 -5.7,3.25; 3 -5.7,2.75; 4 -5.7,2.25; 5 -5.7,1.75; 6 -5.7,1.25; 7 -5.7,0.75; 8 -5.7,0.25; 9 -5.7,-0.25; 10 -5.7,-0.75; 11 -5.7,-1.25; 12 -5.7,-1.75; 13 -5.7,-2.25; 14 -5.7,-2.75; 15 -5.7,-3.25; 16 -5.7,-3.75; 33 5.7,-3.75; 34 5.7,-3.25; 35 5.7,-2.75; 36 5.7,-2.25; 37 5.7,-1.75; 38 5.7,-1.25; 39 5.7,-0.75; 40 5.7,-0.25; 41 5.7,0.25; 42 5.7,0.75; 43 5.7,1.25; 44 5.7,1.75; 45 5.7,2.25; 46 5.7,2.75; 47 5.7,3.25; 48 5.7,3.75 | smd 0.3 x 1.2: 17 -3.75,-5.7; 18 -3.25,-5.7; 19 -2.75,-5.7; 20 -2.25,-5.7; 21 -1.75,-5.7; 22 -1.25,-5.7; 23 -0.75,-5.7; 24 -0.25,-5.7; 25 0.25,-5.7; 26 0.75,-5.7; 27 1.25,-5.7; 28 1.75,-5.7; 29 2.25,-5.7; 30 2.75,-5.7; 31 3.25,-5.7; 32 3.75,-5.7; 49 3.75,5.7; 50 3.25,5.7; 51 2.75,5.7; 52 2.25,5.7; 53 1.75,5.7; 54 1.25,5.7; 55 0.75,5.7; 56 0.25,5.7; 57 -0.25,5.7; 58 -0.75,5.7; 59 -1.25,5.7; 60 -1.75,5.7; 61 -2.25,5.7; 62 -2.75,5.7; 63 -3.25,5.7; 64 -3.75,5.7
TSSOP-20 = smd 0.25 x 1.55: 1 -2.925,-2.8; 2 -2.275,-2.8; 3 -1.625,-2.8; 4 -0.975,-2.8; 5 -0.325,-2.8; 6 0.325,-2.8; 7 0.975,-2.8; 8 1.625,-2.8; 9 2.275,-2.8; 10 2.925,-2.8; 11 2.925,2.8; 12 2.275,2.8; 13 1.625,2.8; 14 0.975,2.8; 15 0.325,2.8; 16 -0.325,2.8; 17 -0.975,2.8; 18 -1.625,2.8; 19 -2.275,2.8; 20 -2.925,2.8
QFN-24 = smd 0.8 x 0.3: 1 -2,1.25; 2 -2,0.75; 3 -2,0.25; 4 -2,-0.25; 5 -2,-0.75; 6 -2,-1.25; 13 2,-1.25; 14 2,-0.75; 15 2,-0.25; 16 2,0.25; 17 2,0.75; 18 2,1.25 | smd 0.3 x 0.8: 7 -1.25,-2; 8 -0.75,-2; 9 -0.25,-2; 10 0.25,-2; 11 0.75,-2; 12 1.25,-2; 19 1.25,2; 20 0.75,2; 21 0.25,2; 22 -0.25,2; 23 -0.75,2; 24 -1.25,2
TDFN-10 = smd 0.3 x 0.7: 1 1,1.475; 2 0.5,1.475; 3 0,1.475; 4 -0.5,1.475; 5 -1,1.475; 6 -1,-1.475; 7 -0.5,-1.475; 8 0,-1.475; 9 0.5,-1.475; 10 1,-1.475 | smd 2.35 x 1.58: PAD 0,0
LQFP32-THERMPAD = smd 1.8 x 0.45: 1 -4.35,2.8; 2 -4.35,2; 3 -4.35,1.2; 4 -4.35,0.4; 5 -4.35,-0.4; 6 -4.35,-1.2; 7 -4.35,-2; 8 -4.35,-2.8; 17 4.4,-2.8; 18 4.4,-2; 19 4.4,-1.2; 20 4.4,-0.4; 21 4.4,0.4; 22 4.4,1.2; 23 4.4,2; 24 4.4,2.8 | smd 0.45 x 1.8: 9 -2.8,-4.35; 10 -2,-4.35; 11 -1.2,-4.35; 12 -0.4,-4.35; 13 0.4,-4.35; 14 1.2,-4.35; 15 2,-4.35; 16 2.8,-4.35; 25 2.8,4.4; 26 2,4.4; 27 1.2,4.4; 28 0.4,4.4; 29 -0.4,4.4; 30 -1.2,4.4; 31 -2,4.4; 32 -2.8,4.4 | smd 5 x 5: PAD 0,0
SOT23-3 = smd 0.8 x 0.9: 1 -0.95,-1.05; 2 0.95,-1.05; 3 0,1.15
BC-32 = smd 0.55 x 0.55: 1B -1.6,-2.4; 1F 1.6,-2.4; 2C -0.8,-1.6; 2D 0,-1.6; 2E 0.8,-1.6; 3B -1.6,-0.8; 3F 1.6,-0.8; 4B -1.6,0; 4F 1.6,0; 5B -1.6,0.8; 5F 1.6,0.8; 6C -0.8,1.6; 6D 0,1.6; 6E 0.8,1.6; 7B -1.6,2.4; 7F 1.6,2.4; AGND 2.4,-1.6; AVCC -2.4,-0.8; CP1 -2.4,0.8; CP2 -2.4,0; CP3 -0.8,2.4; CP4 -2.4,1.6; CP5 0,2.4; NC 0,-2.4; PGND 2.4,1.6; RATEOUT -2.4,-1.6; ST1 2.4,0.8; ST2 2.4,0; SUMJ -0.8,-2.4; TEMP 2.4,-0.8; VDD 0.8,2.4; VRATIO 0.8,-2.4
RN41 = smd 0.8 x 1.6: 1 -6.6,-6.6; 2 -5.4,-6.6; 3 -4.2,-6.6; 4 -3,-6.6; 5 -1.8,-6.6; 6 -0.6,-6.6; 7 0.6,-6.6; 8 1.8,-6.6; 9 3,-6.6; 10 4.2,-6.6; 11 5.4,-6.6; 12 6.6,-6.6; 13 6.6,6.6; 14 5.4,6.6; 15 4.2,6.6; 16 3,6.6; 17 1.8,6.6; 18 0.6,6.6; 19 -0.6,6.6; 20 -1.8,6.6; 21 -3,6.6; 22 -4.2,6.6; 23 -5.4,6.6; 24 -6.6,6.6 | smd 1.6 x 0.8: 25 -9.4,4.8; 26 -9.4,3.2; 27 -9.4,1.6; 28 9.4,3.1; 29 9.4,-3.1; 30 9.4,-4.122; 31 9.4,-1.9; 32 9.4,-0.7; 33 9.4,0.7; 34 9.4,1.9; 35 9.4,4.122
MURATA_CSTCE = smd 0.4 x 1.6: 1 -1.2,0; 2 0,0; 3 1.2,0

### Placement (x,y rotation side)
C1  44.2,14.29 180 top
C2  41.27,13.97 180 top
C3  41.59,8.89 0 top
C4  41.59,6.99 0 top
C5  47.94,11.11 270 top
C6  29.84,17.14 270 bottom
C7  33.02,13.34 180 bottom
C8  35.56,13.34 0 bottom
C9  33.02,22.23 180 bottom
C10  39.05,26.35 270 bottom
C11  35.56,23.5 180 bottom
C12  39.05,29.84 90 bottom
C13  34.92,20.95 0 top
C14  33.66,14.29 0 top
C15  36.83,12.06 270 top
C16  36.83,8.26 270 top
C17  20.48,16.83 0 bottom
C18  20.32,18.41 180 bottom
C19  17.78,16.83 0 bottom
C20  13.97,11.27 270 bottom
C21  15.56,6.35 180 bottom
C22  48.1,20.32 180 bottom
C23  48.26,18.73 0 bottom
C24  50.8,20.32 180 bottom
C25  54.61,25.88 90 bottom
C26  53.02,30.8 0 bottom
C27  35.56,22.23 180 bottom
C28  29.84,19.68 90 bottom
C29  39.05,22.86 270 bottom
C30  21.11,2.7 90 top
C31  23.02,2.7 90 top
C32  24.92,2.7 90 top
C33  26.83,2.7 90 top
C34  28.73,2.7 90 top
C35  30.64,2.7 90 top
C36  32.54,2.7 90 top
C37  34.45,2.7 90 top
C38  40.16,2.7 90 top
C39  42.07,2.7 90 top
C40  45.88,2.7 90 top
C41  43.97,2.7 90 top
C42  47.78,2.7 90 top
C43  49.69,2.7 90 top
C44  51.59,2.7 90 top
C45  53.5,2.7 90 top
C46  55.4,2.7 90 top
C47  63.02,2.7 90 top
C48  57.31,2.7 90 top
C49  59.21,2.7 90 top
C50  61.12,2.7 90 top
C51  64.93,2.7 90 top
C52  66.83,2.7 90 top
C53  38.26,2.7 90 top
C54  36.35,2.7 90 top
C55  59.21,2.7 90 bottom
C56  55.4,2.7 90 bottom
C57  40.16,2.7 90 bottom
C58  43.97,2.7 90 bottom
C59  53.5,2.7 90 bottom
C60  38.26,2.7 90 bottom
C61  45.88,2.7 90 bottom
C62  51.59,2.7 90 bottom
C63  36.35,2.7 90 bottom
C64  30.64,2.7 90 bottom
C65  47.78,2.7 90 bottom
C66  32.54,2.7 90 bottom
C67  64.93,2.7 90 bottom
C68  49.69,2.7 90 bottom
C69  34.45,2.7 90 bottom
C70  63.02,2.7 90 bottom
C71  42.07,2.7 90 bottom
C72  61.12,2.7 90 bottom
C73  57.31,2.7 90 bottom
C_HALL  10.32,28.1 180 top
C_MPU  37.47,17.78 270 top
C_RST  25.08,33.02 90 top
C_V1  18.73,28.89 90 top
C_V2  18.73,20.64 270 top
C_V3  30.8,17.46 270 top
C_V4  31.91,30.8 90 top
C_VA  23.81,33.02 90 top
FB1  38.1,13.34 180 bottom
FB2  38.58,7.94 90 top
IC1  31.75,10.16 90 top
JP1  36.2,33.66 0 top
JP2  34.29,33.66 0 top
JP3  32.38,33.66 0 top
L1  39.69,11.75 90 top
LDBT  12.7,24.77 180 top
LEDB  2.22,19.68 0 top
LEDY  2.22,17.78 0 top
R1  5.08,19.37 0 top
R2  30.8,33.66 270 top
R3  37.78,33.66 270 top
R4  5.08,18.1 0 top
R5  12.7,23.02 0 top
R6  33.02,23.5 180 bottom
R7  46.67,11.11 90 top
R8  16.19,3.17 180 top
R9  16.19,13.34 180 top
R10  26.67,13.02 90 bottom
R11  59.37,16.83 180 top
R12  41.91,24.13 270 bottom
R13  59.37,13.02 180 top
S1  8.89,13.97 0 bottom
S2  8.89,13.97 0 top
S3  8.89,8.89 0 bottom
S4  8.89,8.89 0 top
S5  8.89,3.81 0 bottom
S6  8.89,3.81 0 top
S7  59.69,21.59 180 bottom
S8  59.69,21.59 180 top
S9  59.69,26.67 180 bottom
S10  59.69,26.67 180 top
S11  59.69,31.75 180 bottom
S12  59.69,31.75 180 top
TP1  26.04,17.46 0 top
TP2  26.99,16.19 0 top
TP4  31.43,20 0 top
TP5  27.94,17.46 0 top
TP6  22.54,33.02 180 top
U1  26.04,25.4 270 top
U2  34.29,27.62 90 bottom
U3  34.29,17.78 0 top
U4  43.81,11.75 90 top
U5  20.32,10.48 0 bottom
U6  48.26,26.67 180 bottom
U7  10.32,30.48 90 top
U$1  34.29,17.78 180 bottom
U$2  16.51,27.3 180 bottom
VCAP1  18.73,22.86 90 top
VCAP2  29.53,17.46 270 top
X1  27.54,33.18 180 top

### Tracks (layer width: path | path; a pad name or v marks a point on that pad's centre or on a via)
!RESET
  Top 0.152: U1.7 26.79,31.81 26.53,32.07 25.31,32.07 C_RST.1
  Top 0.254: TP6.TP 24.83,33.02 25.08,32.77 C_RST.1
+5V  (via drill 0.51)
  Top 0.254: C4.1 41.59,8.09 41.59,10 U4.5
  Top 0.406: IC1.1 v33.02,7.86
  Top 0.813: C4.1 38.8,6.99 FB2.1 38.52,7.16 C16.2 35.35,7.16 IC1.1
  Bottom 0.254: C27.1 35.56,22.95 35.56,24.13 36.13,24.7 U2.20 37.94,24.7 C29.1
  Bottom 0.406: C27.1 35.09,21.97 U$1.VRATIO 35.09,19.21 34.45,18.58 | 32.69,18.58 34.45,18.58 | U$1.AVCC 30.95,18.58 30.57,18.96 C28.1 | 34.45,18.58 35.09,17.95 U$1.VDD 35.09,14.76 35.56,14.29 35.56,10.4 v33.02,7.86
ADC_MISO  (via drill 0.33)
  Top 0.152: U1.22 27.01,26.65 v27.3,26.35
  Bottom 0.152: U2.9 29.58,29.9 27.62,27.94 27.62,26.67 v27.3,26.35
ADC_MOSI  (via drill 0.33)
  Top 0.152: U1.23 26.55,26.15 v27.3,25.4
  Bottom 0.152: v27.3,25.4 27.94,26.04 27.94,27.78 29.41,29.25 U2.8
ADC_NSS  (via drill 0.33)
  Top 0.152: U1.20 28.23,27.65 v28.89,26.99
  Bottom 0.152: U2.6 29.06,27.95 28.89,27.78 v28.89,26.99
ADC_SCK  (via drill 0.33)
  Top 0.152: U1.21 27.46,27.15 v28.57,26.04
  Bottom 0.152: v28.57,26.04 28.26,26.35 28.26,27.62 29.23,28.6 U2.7
AGND  (via drill 0.33)
  Bottom 0.254: 35.89,20.18 36.28,20.57 C27.2 | C8.1 FB1.1 | 35.89,15.38 35.89,14.91 36.2,14.61
  other vias: 30.48,21.91 37.31,20.8 37.31,14.76 30.96,15.72 30.48,23.34 40.01,17.78
  pour Bottom (rank 5): 38.1,12.38 30.48,12.38 27.94,14.92 27.94,24.45 29.21,25.72 40.64,25.72 40.64,17.14 38.1,14.61
  pour Route15 (rank 5): 38.1,12.38 30.48,12.38 27.94,14.92 27.94,24.45 29.21,25.72 40.64,25.72 40.64,17.14 38.1,14.61
  pour Bottom (rank 6, no thermals): 40.32,19.21 40.96,19.21 40.96,18.57 40.32,18.57
BT_CTS  (via drill 0.33)
  Top 0.152: U1.14 23.29,29.64 v22.54,28.89
  Bottom 0.152: v22.54,28.89 21.91,28.26 21.91,23.5 20.71,22.3 U$2.15
BT_RTS  (via drill 0.33)
  Top 0.152: U1.15 22.79,30.09 v21.59,28.89
  Bottom 0.152: v21.59,28.89 21.59,23.65 19.51,21.57 U$2.16
BT_RX  (via drill 0.33)
  Top 0.152: U1.17 20.34,29.23 v20.95,29.84
  Bottom 0.152: v20.95,29.84 22.54,29.84 23.18,29.21 23.18,28.57 22.23,27.62 22.23,23.34 21.91,23.02 U$2.14
BT_TX  (via drill 0.33)
  Top 0.152: v21.59,30.48 22.21,31.1 U1.16
  Bottom 0.152: v21.59,30.48 22.86,30.48 23.5,29.84 23.5,28.42 22.54,27.46 22.54,22.38 23.11,21.82 U$2.13
GND  (via drill 0.33)
  Top 0.254: VCAP1.2 18.8,23.65 U1.28
  other vias: 24.45,29.21 1.27,34.61 8.89,31.75 7.62,34.61 19.05,31.75 8.89,26.67 8.89,21.59 13.97,26.67 18.41,26.67 11.43,18.73 16.51,18.73 23.65,23.97 27.3,24.45 40.64,33.02 45.72,34.29 50.16,34.29 43.18,20.32 41.27,17.78 53.34,20.32 53.34,17.78 54.61,19.05 52.07,19.05 6.67,18.73 34.61,11.27 26.04,15.24 33.02,26.04 37.15,23.65 33.02,28.42 4.45,16.99 5.08,20.32 27.54,34.77
  pour Top (rank 6): 0,35.56 68.58,35.56 68.58,0 0,0
  pour Bottom (rank 6): 0,35.56 68.58,35.56 68.58,0 0,0
  pour Route2 (rank 6): 0,35.56 68.58,35.56 68.58,0 0,0
  pour Route15 (rank 6): 0,35.56 68.58,35.56 68.58,0 0,0
HALL  (via drill 0.33)
  Top 0.152: U7.2 v14.93,31.43 | v28.73,22.7 30.68,24.65 U1.55
  Route15 0.305: v14.93,31.43 23.65,22.7 v28.73,22.7
LED1  (via drill 0.33)
  Top 0.254: U1.26 23.22,24.65 v23.81,25.24 | v30.48,31.91 30.8,32.23 R2.2
  Route2 0.305: v23.81,25.24 v30.48,31.91
LED2  (via drill 0.33)
  Top 0.254: U1.29 24.1,23.15 24.61,23.66 v24.61,24.29 | v37.78,32.23 R3.2
  Route2 0.305: v24.61,24.29 24.61,25.24 30.48,31.11 36.67,31.11 v37.78,32.23
LEDB
  Top 0.254: U1.24 17.37,25.65 17.14,25.88 16.51,25.88 14.76,24.13 14.76,21.59 12.54,19.37 R1.2
LEDY
  Top 0.254: U1.33 20.68,18.1 R4.2
M1_A  (via drill 0.51, 1.91)
  Bottom 0.254: U5.25 17.52,16.36 C19.2 16.42,17.46 6.03,17.46 2.54,13.97 v2.22,13.97
  other vias: 3.81,15.56 3.81,12.38 4.76,13.02 4.76,14.92
  pour Top (rank 5, no thermals): 0,11.58 0,16.51 10.64,16.51 10.64,11.58
  pour Bottom (rank 5, no thermals): 0,11.58 0,16.51 6.83,16.51 6.83,11.58
M1_B  (via drill 0.33, 0.51, 1.91)
  Route2 0.508: v2.22,8.89 5.08,8.89 6.03,9.84 v13.97,9.84
  Bottom 0.254: v13.97,9.84 C20.2
  Bottom 0.305: C20.2 14.3,10.88 U5.21
  other vias: 4.76,9.84 3.81,10.48 4.76,7.94 3.81,7.3
  pour Top (rank 5, no thermals): 0,6.5 0,11.28 10.64,11.28 10.64,6.5
  pour Bottom (rank 5, no thermals): 0,6.5 0,11.28 6.83,11.28 6.83,6.5
M1_C  (via drill 0.33, 0.51, 1.91)
  Route2 0.508: v2.22,3.81 12.38,3.81 v13.97,5.4
  Bottom 0.254: C21.2 16.5,6.13 U5.16 | 16.28,6.12 C21.2 | v13.97,5.4 15.33,5.4 C21.2
  other vias: 3.81,5.4 4.76,4.76 4.76,2.86 3.81,2.22
  pour Top (rank 5, no thermals): 0,0 0,6.2 10.64,6.2 10.64,0
  pour Bottom (rank 5, no thermals): 0,0 0,6.2 6.83,6.2 6.83,0
M1_DIAG  (via drill 0.33)
  Top 0.152: U1.25 v16.83,25.15
  Route2 0.305: v16.83,25.15 21.11,25.15 24.13,22.13 24.13,10.71 24.77,10.08 v26.04,10.08
  Bottom 0.152: U5.5 v26.04,10.08
M1_LSS  (via drill 0.33)
  Bottom 0.254: U5.13 U5.14 19.12,7.62 v17.46,7.62
  pour Top (rank 5, no thermals): 10.95,16.51 10.95,0 17.63,0 17.63,16.51
M1_MISO  (via drill 0.33)
  Top 0.152: U1.35 23.29,17.51 24.45,16.35 24.45,6.99 24.77,6.67 24.77,6.03 24.45,5.71 23.81,5.71 23.34,6.19 v23.34,7.68
  Bottom 0.152: U5.8 v23.34,7.68
M1_MOSI  (via drill 0.33)
  Top 0.152: U1.36 23.79,17.49 24.77,16.51 24.77,7.14 25.08,6.83 25.08,5.87 24.61,5.4 23.65,5.4 23.02,6.03 23.02,6.76 v22.32,7.46
  Bottom 0.152: U5.10 v22.32,7.46
M1_NSS  (via drill 0.33)
  Top 0.152: U1.37 24.29,17.47 25.08,16.67 25.08,8.1 25.56,7.62 v26.19,7.62
  Bottom 0.152: U5.11 21.52,5.11 21.71,4.92 23.65,4.92 26.19,7.46 v26.19,7.62
M1_PWM  (via drill 0.33)
  Top 0.152: U1.27 v16.83,24.15
  Route2 0.305: v16.83,24.15 20.8,24.15 23.34,21.61 v23.34,9.28
  Bottom 0.152: v23.34,9.28 U5.6
M1_SCK  (via drill 0.33)
  Top 0.152: v24.13,6.35 24.13,16.19 22.79,17.54 U1.34
  Bottom 0.152: U5.9 23.91,6.13 v24.13,6.35
M1_TACHO  (via drill 0.33)
  Top 0.152: U1.30 19.42,22.65 19.21,22.86 v16.83,22.86
  Route2 0.305: v16.83,22.86 20.48,22.86 22.54,20.8 22.54,8.99 23.05,8.48 v26.04,8.48
  Bottom 0.152: U5.7 v26.04,8.48
M2_A  (via drill 0.33, 0.51, 1.91)
  Route15 0.508: v66.36,21.59 v52.8,21.59
  Bottom 0.254: U6.25 51.06,20.79 C24.2 v52.8,21.59
  other vias: 63.82,22.54 64.77,23.18 63.82,20.64 64.77,20
  pour Top (rank 5, no thermals): 57.94,23.98 68.58,23.98 68.58,19.2 57.94,19.2
  pour Bottom (rank 5, no thermals): 61.75,23.98 68.58,23.98 68.58,19.2 61.75,19.2
M2_B  (via drill 0.33, 0.51, 1.91)
  Route15 0.508: v54.61,27.3 62.87,27.3 63.5,26.67 v66.36,26.67
  Bottom 0.254: U6.21 54.28,26.27 C25.2 v54.61,27.3
  other vias: 64.77,28.26 63.82,27.62 63.82,25.72 64.77,25.08
  pour Top (rank 5, no thermals): 57.94,29.06 68.58,29.06 68.58,24.28 57.94,24.28
  pour Bottom (rank 5, no thermals): 61.75,29.06 68.58,29.06 68.58,24.28 61.75,24.28
M2_C  (via drill 0.33, 0.51, 1.91)
  Route15 0.508: v66.36,31.75 v54.61,31.75
  Bottom 0.254: v54.61,31.75 53.25,31.75 C26.2 52.08,31.02 U6.16
  other vias: 64.77,30.16 63.82,30.8 63.82,32.7 64.77,33.34
  pour Top (rank 5, no thermals): 57.94,35.56 68.58,35.56 68.58,29.36 57.94,29.36
  pour Bottom (rank 5, no thermals): 61.75,35.56 68.58,35.56 68.58,29.36 61.75,29.36
M2_DIAG  (via drill 0.33)
  Top 0.152: v24.94,17.78 24.79,17.94 U1.38
  Route2 0.305: v45.24,27.07 35.95,17.78 v24.94,17.78
  Bottom 0.152: U6.5 v45.24,27.07
M2_LSS  (via drill 0.33)
  Bottom 0.254: U6.13 U6.14 49.46,29.53 v51.12,29.53
  pour Top (rank 5, no thermals): 57.63,35.56 57.63,9.21 55.09,6.67 50.97,6.67 50.97,35.56
M2_MISO  (via drill 0.33)
  Top 0.152: v40.8,28.99 40.8,28.26 37.6,25.05 34.58,25.05 32.67,23.15 U1.52
  Bottom 0.152: v40.8,28.99 41.27,29.47 U6.8
M2_MOSI  (via drill 0.33)
  Top 0.152: v40.01,28.57 40.01,27.94 37.46,25.4 34.45,25.4 34.29,25.24 32.7,23.65 U1.53
  Bottom 0.152: v40.01,28.57 40.01,29.03 43.18,32.21 46.07,32.23 46.26,32.03 U6.10
M2_NSS  (via drill 0.33)
  Top 0.152: v40.01,29.84 39.37,29.21 39.37,27.78 37.33,25.74 34.31,25.74 32.72,24.15 U1.54
  Bottom 0.152: v40.01,29.84 42.7,32.54 46.81,32.54 47.06,32.29 U6.11
M2_PWM  (via drill 0.33)
  Top 0.152: v25.44,18.57 25.29,18.73 U1.39
  Route2 0.305: v42.55,27.87 33.25,18.57 v25.44,18.57
  Bottom 0.152: U6.6 v42.55,27.87
M2_SCK  (via drill 0.33)
  Top 0.152: v42.7,30.16 41.43,28.89 41.43,28.42 37.73,24.71 34.72,24.71 32.65,22.65 U1.51
  Bottom 0.152: v42.7,30.16 43.56,31.02 U6.9
M2_TACHO  (via drill 0.33)
  Top 0.152: v42.07,28.57 37.87,24.37 34.85,24.37 32.63,22.15 U1.50
  Bottom 0.152: U6.7 43.81,28.57 v42.07,28.57
MPU_SCL
  Top 0.152: U1.61 35.11,27.65 39.21,31.75 43.97,31.75 45.56,30.16 45.56,28.73 39.05,22.23 34.29,22.23 33.54,21.48 U3.23
MPU_SDA
  Top 0.152: U1.59 34.59,26.65 39.37,31.43 43.81,31.43 45.24,30 45.24,28.89 38.89,22.54 34.13,22.54 33.04,21.45 U3.24
N$1
  Top 0.254: U1.6 27.29,31.93 26.34,32.88 X1.3
N$2
  Top 0.254: U1.5 27.79,31.91 28.73,32.86 X1.1
N$3
  Top 0.254: U1.47 29.29,18.43 VCAP2.1
N$4
  Top 0.254: VCAP1.1 18.75,22.15 U1.31
N$5
  Top 0.406: LEDB.+ 3.64,19.37 R1.1
N$6
  Top 0.305: JP1.1 37.06,33.66 R3.1
N$7
  Top 0.254: R2.1 31.52,33.66 JP3.1
N$8
  Top 0.381: U4.1 42,13.09 C2.1
N$9
  Bottom 0.254: U$1.CP1 31.27,16.98 30.71,16.42 C6.2
N$10
  Bottom 0.254: U$1.CP2 29.93,17.78 C6.1
N$11
  Bottom 0.254: U$1.CP3 33.49,13.59 C7.2
N$12
  Bottom 0.254: 32.69,15.38 32.69,13.73 C7.1
N$13
  Bottom 0.254: U$1.CP5 34.29,14.61 34.84,14.06 C8.2
N$14
  Bottom 0.254: 32.69,20.18 32.69,20.97 32.3,21.36 C9.1 R6.1 31.49,24.3 U2.1
N$15
  Bottom 0.254: R6.2 C9.2 33.74,21.36 33.49,21.11 U$1.SUMJ
N$16
  Bottom 0.254: U2.2 33.92,25.35 | 33.92,25.35 35.87,27.3 U2.16 | 33.92,25.35 34.84,24.43 C11.1
N$17
  Bottom 0.254: U2.18 38.68,26 C10.2
N$18
  Bottom 0.254: U2.17 38.62,26.65 C10.1
N$19
  Bottom 0.254: U2.13 38.06,29.25 38.19,29.12 C12.1
N$20
  Top 0.254: C13.2 35.04,20.34 U3.20
N$21
  Top 0.254: C14.2 34.38,14.85 34.54,15.01 U3.10
N$22
  Top 0.813: C2.2 40.23,13.39 L1.2
  pour Top (rank 5, no thermals): 38.1,13.34 38.42,13.34 39.69,14.61 40.64,14.61 40.64,13.34 41.91,13.34 41.91,12.06 42.86,12.06 42.86,11.43 41.91,11.43 41.91,11.11 38.1,11.11
N$23
  Top 0.813: C3.1 38.8,8.89 FB2.2 | 39.94,10.39 L1.1
  Top 1.118: C3.1 39.94,10.39
N$24
  Bottom 0.254: C17.1 20.72,16.34 U5.29
N$25
  Bottom 0.254: C17.2 19.92,16.66 U5.28
N$26
  Bottom 0.305: C18.1 19.12,18.32 U5.27
N$28
  Top 0.305: U4.8 46.58,11.75 R7.2 C5.1
N$29
  Top 0.305: R7.1 46.31,10.75 U4.6
N$30
  Bottom 0.254: S1.G 6.14,16.83 15.92,16.83 U5.24
N$31  (via drill 0.33)
  Top 0.254: S2.G v12.7,15.95
  Bottom 0.254: v12.7,15.95 12.7,14.61 14.83,12.48 U5.23
N$32  (via drill 0.33)
  Top 0.406: R5.2 13.43,22.14 v13.51,22.05
  Bottom 0.406: v13.51,22.05 U$2.21
N$33
  Top 0.406: LDBT.+ 11.97,24.39 R5.1
N$34
  Bottom 0.254: C22.2 48.66,20.49 U6.28
  cutout Bottom (rank 6): 0,33.66 8.26,33.66 8.26,20.95 0,20.95
N$35
  Top 0.406: LEDY.+ 3.64,18.1 R4.1
N$36
  Bottom 0.254: C22.1 47.86,20.8 U6.29
  cutout Top (rank 6): 0,33.66 8.26,33.66 8.26,20.95 0,20.95
  cutout Route2 (rank 6): 0,33.66 8.26,33.66 8.26,20.95 0,20.95
  cutout Route15 (rank 6): 0,33.66 8.26,33.66 8.26,20.95 0,20.95
N$37
  Bottom 0.254: C19.1 18.32,16.64 U5.26
N$39  (via drill 0.33)
  Route15 0.508: v5.08,10.87 5.96,11.75 15.6,11.75 v17.27,10.08
  Bottom 0.254: S3.G v5.08,10.87 | U5.20 v17.27,10.08
N$40  (via drill 0.33)
  Top 0.254: S4.G v12.7,10.87
  Bottom 0.254: v12.7,10.87 12.7,9.28 13.09,8.89 14.29,8.89 14.68,9.28 U5.19
N$41
  Bottom 0.305: C20.1 14.29,11.68 U5.22
N$42  (via drill 0.33)
  Route15 0.508: v5.08,5.79 7.23,7.94 v14.29,7.94
  Bottom 0.254: S5.G v5.08,5.79 | v14.29,7.94 14.83,8.48 U5.18
N$44  (via drill 0.33)
  Top 0.254: S6.G v12.7,5.79
  Bottom 0.254: v12.7,5.79 12.7,4.76 18.32,4.76 U5.15
N$45
  Bottom 0.254: C21.1 14.83,6.59 U5.17
N$47
  Bottom 0.305: C23.1 49.46,18.83 U6.27
N$48
  Bottom 0.254: U5.2 26.48,12.48 R10.1
N$50  (via drill 0.33)
  Route2 0.508: v63.5,19.61 60.3,22.82 v52.66,22.82
  Bottom 0.254: S7.G v63.5,19.61 | U6.24 v52.66,22.82
N$51  (via drill 0.33)
  Top 0.254: S8.G v55.88,19.61
  Bottom 0.254: v55.88,19.61 55.88,22.54 53.75,24.67 U6.23
N$52
  Bottom 0.254: C24.1 50.26,20.5 U6.26
N$54  (via drill 0.33)
  Route2 0.508: v51.31,27.07 52.34,26.04 62.16,26.04 v63.5,24.69
  Bottom 0.254: S9.G v63.5,24.69 | v51.31,27.07 U6.20
N$55  (via drill 0.33)
  Top 0.254: S10.G v55.88,24.69
  Bottom 0.254: U6.19 53.75,27.87 53.98,28.1 55.4,28.1 55.88,27.62 v55.88,24.69
N$56
  Bottom 0.254: U6.22 54.29,25.47 C25.1
N$57  (via drill 0.33)
  Route2 0.508: v63.5,29.77 62.72,28.99 v54.88,28.99
  Bottom 0.254: S11.G v63.5,29.77 | U6.18 54.56,28.67 v54.88,28.99
N$59  (via drill 0.33)
  Top 0.254: S12.G v55.88,29.77
  Bottom 0.254: v55.88,29.77 55.88,32.38 50.26,32.38 U6.15
N$60
  Bottom 0.254: U6.17 53.75,30.56 C26.1
N$62
  Bottom 0.254: R12.1 42.09,24.67 U6.2
SWCLK
  Top 0.254: U1.49 31.73,21.26 31.43,20.95 TP4.TP
SWDIO
  Top 0.254: U1.46 28.79,18.78 27.94,17.94 TP5.TP
U1_RX
  Top 0.254: U1.43 27.29,18.55 26.99,18.26 TP2.TP
U1_TX
  Top 0.254: U1.42 26.79,19.01 26.04,18.26 TP1.TP
V+  (via drill 0.33, 0.51, 2.54)
  Top 0.152: C1.1 44.34,15.24 41.91,15.24 41.27,14.61 41.27,12.7 41.73,12.25 U4.2
  Top 0.381: C1.1 U4.10
  Top 0.406: C1.1 45.3,18.31 v45.46,18.47
  Bottom 0.406: R12.2 42.38,23.87 U6.1 43.91,23.82 U6.32 v45.46,18.47 45.46,17.14 | U5.32 23.12,14.83 U5.1 26.2,13.28 R10.2 27.94,12.47 27.94,10.16
  other vias: 64.45,1.43 65.41,1.43 64.93,0.79 62.55,0.79 63.5,0.79 63.02,1.43 66.36,0.79 67.31,0.79 66.83,1.43 60.64,1.43 61.59,1.43 61.12,0.79 58.74,0.79 59.69,0.79 59.21,1.43 26.35,1.43 27.3,1.43 26.83,0.79 24.45,0.79 25.4,0.79 24.92,1.43 22.54,1.43 23.5,1.43 23.02,0.79 20.64,0.79 21.59,0.79 21.11,1.43 33.97,1.43 34.92,1.43 34.45,0.79 32.07,0.79 33.02,0.79 32.54,1.43 35.88,0.79 36.83,0.79 36.35,1.43 30.16,1.43 31.11,1.43 30.64,0.79 28.26,0.79 29.21,0.79 28.73,1.43 37.78,1.43 38.73,1.43 38.26,0.79 45.4,1.43 46.35,1.43 45.88,0.79 43.5,0.79 44.45,0.79 43.97,1.43 41.59,1.43 42.55,1.43 42.07,0.79 39.69,0.79 40.64,0.79 40.16,1.43 53.02,1.43 53.98,1.43 53.5,0.79 51.12,0.79 52.07,0.79 51.59,1.43 54.93,0.79 55.88,0.79 55.4,1.43 49.21,1.43 50.16,1.43 49.69,0.79 47.31,0.79 48.26,0.79 47.78,1.43 56.83,1.43 57.78,1.43 57.31,0.79 66.04,10.16
  pour Bottom (rank 5, no thermals): 55.88,35.56 61.44,35.56 61.44,18.9 68.58,18.9 68.58,0 7.14,0 7.14,16.51 12.7,16.51 12.7,5.08 23.34,5.08 23.34,10.16 40.64,10.16 43.18,12.7 43.18,15.88 44.45,17.14 54.61,17.14 55.88,18.41
  pour Top (rank 4, no thermals): 68.58,1.75 20.16,1.75 20.16,0 68.58,0
V-  (via drill 0.33, 2.54)
  Top 0.254: 50.8,6.35 50.8,25.4 47.86,28.34 v47.86,32.62
  Top 0.305: U4.PAD 43.31,11.25 U4.4
  Top 0.813: C4.2 43.24,7.54 C3.2 43.24,9.9 43.81,10.48 U4.PAD 43.81,13.57 C1.2
  Bottom 0.152: v20.72,7.46 U5.12
  Bottom 0.254: U6.12 v47.86,32.62
  other vias: 64.93,4.6 64.45,3.97 65.41,3.97 62.55,4.6 63.5,4.6 63.02,3.97 61.12,4.6 60.64,3.97 61.59,3.97 58.74,4.6 59.69,4.6 59.21,3.97 57.31,4.6 56.83,3.97 57.78,3.97 54.93,4.6 55.88,4.6 55.4,3.97 53.5,4.6 53.02,3.97 53.98,3.97 51.12,4.6 52.07,4.6 51.59,3.97 49.69,4.6 49.21,3.97 50.16,3.97 47.31,4.6 48.26,4.6 47.78,3.97 45.88,4.6 45.4,3.97 46.35,3.97 43.5,4.6 44.45,4.6 43.97,3.97 42.07,4.6 41.59,3.97 42.55,3.97 39.69,4.6 40.64,4.6 40.16,3.97 38.26,4.6 37.78,3.97 38.73,3.97 35.88,4.6 36.83,4.6 36.35,3.97 34.45,4.6 33.97,3.97 34.92,3.97 32.07,4.6 33.02,4.6 32.54,3.97 30.64,4.6 30.16,3.97 31.11,3.97 66.04,15.24
  pour Top (rank 5, no thermals): 57.94,18.9 68.58,18.9 68.58,0 17.93,0 17.93,16.51 24.13,16.51 24.13,6.35 55.27,6.35 57.94,9.02
  pour Top (rank 6, no thermals): 31.43,6.67 31.43,6.03 32.07,6.03 32.07,6.67
  pour Bottom (rank 4, no thermals): 29.69,5.08 65.88,5.08 65.88,3.65 29.69,3.65
VDD  (via drill 0.51)
  Top 0.254: C_V1.1 18.75,28.15 | C_VA.1 23.79,32.27 | U3.8 33.54,15.27 33.35,15.08 31.59,15.08 | 31.59,15.08 31.59,18 31.4,18.19 C_V3.1 | 31.59,15.08 31.59,12.46
  Top 0.305: 18.75,28.15 U1.19 23.79,28.15 | 23.79,28.15 U1.13 23.79,32.27 | 23.79,28.15 29.1,28.15 | 29.1,28.15 30.1,29.15 | 30.1,29.15 U1.64 | 29.1,28.15 29.79,27.47 29.79,25.18 26.25,21.65 | C_V2.1 19.46,21.36 19.75,21.65 U1.32 26.25,21.65 | U3.8 33.54,16.34 33.73,16.53 U3.13 36.94,16.53 C_MPU.2 | C_V3.1 29.79,19.2 U1.48 29.79,20.7 28.83,21.65 26.25,21.65 | IC1.3 31.59,12.46 27.18,12.46 26.67,11.95 v26.67,10.88 | 30.1,29.15 29.79,29.47 U1.1 | U1.64 34.54,29.15 v34.61,29.22 | U1.64 31.91,29.15 C_V4.1 | LDBT.- 14.61,24.77 18.01,28.17 | 18.01,28.17 C_V1.1 | 18.01,28.17 16.64,29.53 U7.1 11.37,28.99 11.04,28.66 C_HALL.1
  Top 0.813: IC1.3 35.35,13.16 C15.1
  Bottom 0.305: U6.3 U6.4 41.36,26.27 39.68,27.95 U2.15 35.88,27.95 v34.61,29.22 31.12,32.7 22.16,32.7 21.91,32.96 U$2.11 | U5.3 U5.4 v26.67,10.88

### Text on the board
tPlace: - | +